# Altium project mcHFPro_ui.PrjPcb (part 1 of 2)
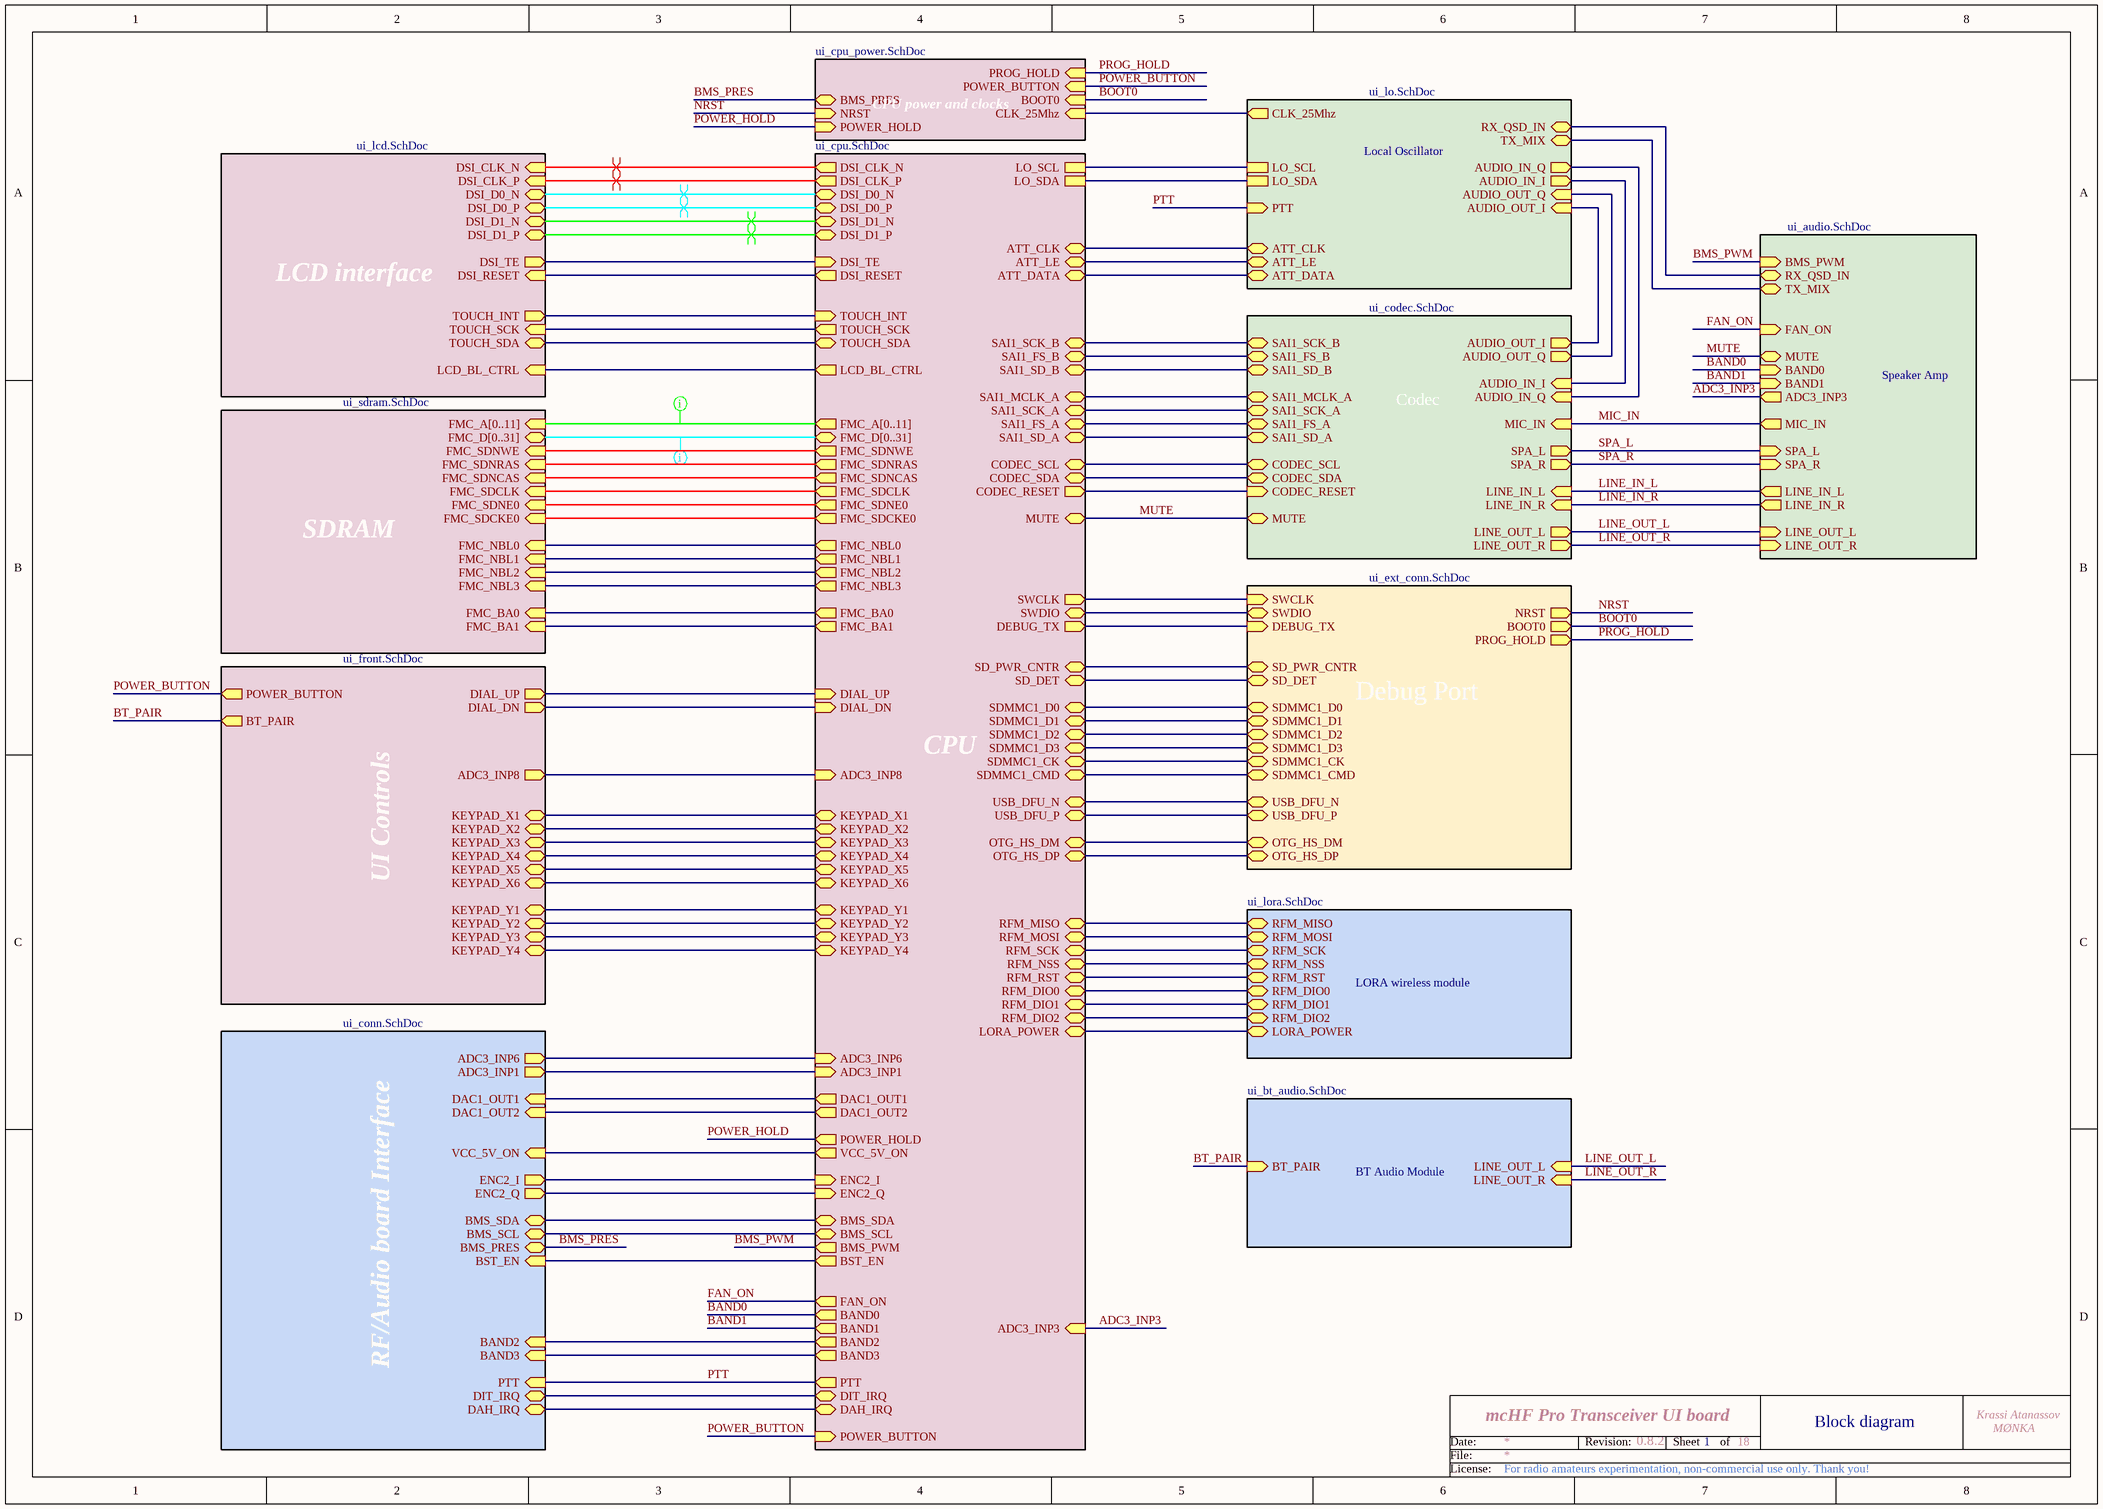
[diagram p0: ui_main.SchDoc]
13 sheets, 345 parts. Net scope: hierarchical (ports join the sheet entries above them; power ports are global).
Board file: mchf_pro_ui.PcbDoc
Sheets:
  ui_main.SchDoc
    UI Controls = ui_front.SchDoc
    RF/Audio board Interface = ui_conn.SchDoc
    CPU = ui_cpu.SchDoc
    SDRAM = ui_sdram.SchDoc
    LCD interface = ui_lcd.SchDoc
    CPU power and clocks = ui_cpu_power.SchDoc
    Local Oscillator = ui_lo.SchDoc
    Debug Port = ui_ext_conn.SchDoc
    Codec = ui_codec.SchDoc
    LORA wireless module = ui_lora.SchDoc
    Speaker Amp = ui_audio.SchDoc
    BT Audio Module = ui_bt_audio.SchDoc

## Sheet ui_main.SchDoc: mcHF Pro Transceiver UI board
size A3; Author: Krassi Atanassov; CompanyName: MØNKA; Engineer: For radio amateurs experimentation, non-commercial use only. Thank you!; Revision: 0.8.2; SheetTotal: 18

### Sub-sheets
BT Audio Module = ui_bt_audio.SchDoc: BT_PAIR (in), LINE_OUT_L (in), LINE_OUT_R (in)
Codec = ui_codec.SchDoc: CODEC_SCL (bidir), CODEC_RESET (in), CODEC_SDA (bidir), AUDIO_OUT_I (out), AUDIO_OUT_Q (out), AUDIO_IN_I (in), AUDIO_IN_Q (in), MIC_IN (in), SPA_L (out), MUTE (bidir), LINE_IN_L (in), LINE_IN_R (in), LINE_OUT_L (out), LINE_OUT_R (out), SPA_R (out), SAI1_SCK_B (bidir), SAI1_FS_B (bidir), SAI1_SD_B (bidir), SAI1_MCLK_A (bidir), SAI1_SCK_A (bidir), SAI1_FS_A (bidir), SAI1_SD_A (bidir)
CPU = ui_cpu.SchDoc: FMC_A[0..11] (out), FMC_D[0..31] (bidir), FMC_SDNWE (out), FMC_SDNRAS (out), FMC_SDNCAS (out), FMC_SDCLK (out), FMC_BA0 (out), FMC_BA1 (out), FMC_SDNE0 (out), FMC_SDCKE0 (out), FMC_NBL0 (out), FMC_NBL1 (out), DIAL_UP (in), DIAL_DN (in), FMC_NBL2 (out), FMC_NBL3 (out), SWCLK (out), SWDIO (bidir), SDMMC1_D0 (bidir), SDMMC1_D1 (bidir), SDMMC1_D2 (bidir), SDMMC1_D3 (bidir), SDMMC1_CK (bidir), SDMMC1_CMD (bidir), RFM_DIO0 (bidir), RFM_DIO1 (bidir), RFM_DIO2 (bidir), LORA_POWER (bidir), DSI_CLK_N (out), DSI_CLK_P (out), DSI_D0_N (bidir), DSI_D0_P (bidir), DSI_D1_N (bidir), DSI_D1_P (bidir), LCD_BL_CTRL (out), TOUCH_INT (in), TOUCH_SCK (out), TOUCH_SDA (bidir), DSI_TE (in), DSI_RESET (out), LO_SCL, LO_SDA, KEYPAD_X2 (bidir), KEYPAD_X4 (bidir), KEYPAD_X3 (bidir), KEYPAD_X5 (bidir), KEYPAD_X6 (bidir), KEYPAD_Y1 (bidir), KEYPAD_Y2 (bidir), KEYPAD_Y3 (bidir), ADC3_INP6 (in), KEYPAD_Y4 (bidir), ADC3_INP1 (in), POWER_HOLD (out), DAC1_OUT1 (out), DAC1_OUT2 (out), KEYPAD_X1 (bidir), CODEC_SCL (bidir), CODEC_SDA (bidir), SAI1_SCK_B (bidir), SAI1_FS_B (bidir), SAI1_SD_B (bidir), SAI1_MCLK_A (bidir), SAI1_SCK_A (bidir), SAI1_FS_A (bidir), SAI1_SD_A (bidir), DEBUG_TX (out), VCC_5V_ON (out), RFM_MISO (bidir), RFM_MOSI (bidir), RFM_NSS (bidir), BAND0 (out), BAND1 (out), BAND2 (out), BAND3 (out), PTT (out), DIT_IRQ (bidir), DAH_IRQ (bidir), ADC3_INP8 (in), USB_DFU_N (bidir), USB_DFU_P (bidir), CODEC_RESET (out), POWER_BUTTON (in), MUTE (bidir), RFM_SCK (bidir), SD_DET (bidir), SD_PWR_CNTR (bidir), OTG_HS_DM (bidir), OTG_HS_DP (bidir), RFM_RST (bidir), BMS_SDA (bidir), BMS_SCL (bidir), ENC2_I (in), ENC2_Q (in), FAN_ON (out), ATT_CLK (bidir), ATT_LE (bidir), ATT_DATA (bidir), ADC3_INP3 (in), BMS_PWM (out), BST_EN (out)
CPU power and clocks = ui_cpu_power.SchDoc: NRST (in), CLK_25Mhz (in), POWER_HOLD (in), POWER_BUTTON (in), BOOT0 (in), BMS_PRES (bidir), PROG_HOLD (in)
Debug Port = ui_ext_conn.SchDoc: SWCLK (in), SWDIO (bidir), NRST (out), SD_PWR_CNTR (bidir), SD_DET (bidir), DEBUG_TX (in), USB_DFU_N (bidir), USB_DFU_P (bidir), SDMMC1_D0 (bidir), SDMMC1_D1 (bidir), SDMMC1_D2 (bidir), SDMMC1_D3 (bidir), SDMMC1_CK (bidir), SDMMC1_CMD (bidir), OTG_HS_DM (bidir), OTG_HS_DP (bidir), BOOT0 (out), PROG_HOLD (out)
LCD interface = ui_lcd.SchDoc: DSI_CLK_N (in), LCD_BL_CTRL (in), TOUCH_INT (out), TOUCH_SCK (in), TOUCH_SDA (bidir), DSI_CLK_P (in), DSI_D0_N (bidir), DSI_D0_P (bidir), DSI_D1_N (bidir), DSI_D1_P (bidir), DSI_TE (out), DSI_RESET (in)
Local Oscillator = ui_lo.SchDoc: LO_SCL, LO_SDA, CLK_25Mhz (out), AUDIO_OUT_I (in), AUDIO_OUT_Q (in), AUDIO_IN_I (out), AUDIO_IN_Q (out), TX_MIX (bidir), RX_QSD_IN (bidir), PTT (in), ATT_CLK (bidir), ATT_LE (bidir), ATT_DATA (bidir)
LORA wireless module = ui_lora.SchDoc: RFM_MISO (bidir), RFM_MOSI (bidir), RFM_SCK (bidir), RFM_NSS (bidir), RFM_RST (bidir), RFM_DIO0 (bidir), LORA_POWER (bidir), RFM_DIO1 (bidir), RFM_DIO2 (bidir)
RF/Audio board Interface = ui_conn.SchDoc: ADC3_INP6 (out), ADC3_INP1 (out), DAC1_OUT1 (in), DAC1_OUT2 (in), VCC_5V_ON (in), BAND2 (in), BAND3 (in), PTT (in), DIT_IRQ (bidir), DAH_IRQ (bidir), BMS_SDA (bidir), BMS_SCL (bidir), BMS_PRES (bidir), ENC2_I (out), ENC2_Q (out), BST_EN (in)
SDRAM = ui_sdram.SchDoc: FMC_A[0..11] (in), FMC_D[0..31] (bidir), FMC_SDNWE (in), FMC_SDNRAS (in), FMC_SDNCAS (in), FMC_SDCLK (in), FMC_BA0 (in), FMC_BA1 (in), FMC_NBL0 (in), FMC_NBL1 (in), FMC_SDNE0 (in), FMC_SDCKE0 (in), FMC_NBL2 (in), FMC_NBL3 (in)
Speaker Amp = ui_audio.SchDoc: MIC_IN (out), SPA_L (in), MUTE (bidir), LINE_IN_L (out), LINE_IN_R (out), LINE_OUT_L (in), LINE_OUT_R (in), SPA_R (in), BMS_PWM (in), TX_MIX (bidir), RX_QSD_IN (bidir), BAND0 (in), BAND1 (in), FAN_ON (in), ADC3_INP3 (out)
UI Controls = ui_front.SchDoc: KEYPAD_X1 (bidir), KEYPAD_X2 (bidir), KEYPAD_X3 (bidir), KEYPAD_X4 (bidir), KEYPAD_X5 (bidir), KEYPAD_X6 (bidir), KEYPAD_Y1 (bidir), KEYPAD_Y2 (bidir), KEYPAD_Y3 (bidir), KEYPAD_Y4 (bidir), DIAL_UP (out), DIAL_DN (out), POWER_BUTTON (out), ADC3_INP8 (out), BT_PAIR (out)

### Nets
ADC3_INP1: sheet RF/Audio board Interface/ADC3_INP1, sheet CPU/ADC3_INP1
ADC3_INP3: sheet CPU/ADC3_INP3, sheet Speaker Amp/ADC3_INP3
ADC3_INP6: sheet RF/Audio board Interface/ADC3_INP6, sheet CPU/ADC3_INP6
ADC3_INP8: sheet UI Controls/ADC3_INP8, sheet CPU/ADC3_INP8
ATT_CLK: sheet CPU/ATT_CLK, sheet Local Oscillator/ATT_CLK
ATT_DATA: sheet CPU/ATT_DATA, sheet Local Oscillator/ATT_DATA
ATT_LE: sheet CPU/ATT_LE, sheet Local Oscillator/ATT_LE
BAND0: sheet CPU/BAND0, sheet Speaker Amp/BAND0
BAND1: sheet CPU/BAND1, sheet Speaker Amp/BAND1
BAND2: sheet RF/Audio board Interface/BAND2, sheet CPU/BAND2
BAND3: sheet RF/Audio board Interface/BAND3, sheet CPU/BAND3
BMS_PRES: sheet RF/Audio board Interface/BMS_PRES, sheet CPU power and clocks/BMS_PRES
BMS_PWM: sheet CPU/BMS_PWM, sheet Speaker Amp/BMS_PWM
BMS_SCL: sheet RF/Audio board Interface/BMS_SCL, sheet CPU/BMS_SCL
BMS_SDA: sheet RF/Audio board Interface/BMS_SDA, sheet CPU/BMS_SDA
BOOT0: sheet CPU power and clocks/BOOT0, sheet Debug Port/BOOT0
BST_EN: sheet RF/Audio board Interface/BST_EN, sheet CPU/BST_EN
BT_PAIR: sheet UI Controls/BT_PAIR, sheet BT Audio Module/BT_PAIR
CODEC_RESET: sheet CPU/CODEC_RESET, sheet Codec/CODEC_RESET
CODEC_SCL: sheet CPU/CODEC_SCL, sheet Codec/CODEC_SCL
CODEC_SDA: sheet CPU/CODEC_SDA, sheet Codec/CODEC_SDA
DAC1_OUT1: sheet RF/Audio board Interface/DAC1_OUT1, sheet CPU/DAC1_OUT1
DAC1_OUT2: sheet RF/Audio board Interface/DAC1_OUT2, sheet CPU/DAC1_OUT2
DAH_IRQ: sheet RF/Audio board Interface/DAH_IRQ, sheet CPU/DAH_IRQ
DIAL_DN: sheet UI Controls/DIAL_DN, sheet CPU/DIAL_DN
DIAL_UP: sheet UI Controls/DIAL_UP, sheet CPU/DIAL_UP
DIT_IRQ: sheet RF/Audio board Interface/DIT_IRQ, sheet CPU/DIT_IRQ
DSI_CLK_N: sheet CPU/DSI_CLK_N, sheet LCD interface/DSI_CLK_N
DSI_CLK_P: sheet CPU/DSI_CLK_P, sheet LCD interface/DSI_CLK_P
DSI_D0_N: sheet CPU/DSI_D0_N, sheet LCD interface/DSI_D0_N
DSI_D0_P: sheet CPU/DSI_D0_P, sheet LCD interface/DSI_D0_P
DSI_D1_N: sheet CPU/DSI_D1_N, sheet LCD interface/DSI_D1_N
DSI_D1_P: sheet CPU/DSI_D1_P, sheet LCD interface/DSI_D1_P
DSI_RESET: sheet CPU/DSI_RESET, sheet LCD interface/DSI_RESET
DSI_TE: sheet CPU/DSI_TE, sheet LCD interface/DSI_TE
ENC2_I: sheet RF/Audio board Interface/ENC2_I, sheet CPU/ENC2_I
ENC2_Q: sheet RF/Audio board Interface/ENC2_Q, sheet CPU/ENC2_Q
FAN_ON: sheet CPU/FAN_ON, sheet Speaker Amp/FAN_ON
FMC_BA0: sheet CPU/FMC_BA0, sheet SDRAM/FMC_BA0
FMC_BA1: sheet CPU/FMC_BA1, sheet SDRAM/FMC_BA1
FMC_NBL0: sheet CPU/FMC_NBL0, sheet SDRAM/FMC_NBL0
FMC_NBL1: sheet CPU/FMC_NBL1, sheet SDRAM/FMC_NBL1
FMC_NBL2: sheet CPU/FMC_NBL2, sheet SDRAM/FMC_NBL2
FMC_NBL3: sheet CPU/FMC_NBL3, sheet SDRAM/FMC_NBL3
FMC_SDCKE0: sheet CPU/FMC_SDCKE0, sheet SDRAM/FMC_SDCKE0
FMC_SDCLK: sheet CPU/FMC_SDCLK, sheet SDRAM/FMC_SDCLK
FMC_SDNCAS: sheet CPU/FMC_SDNCAS, sheet SDRAM/FMC_SDNCAS
FMC_SDNE0: sheet CPU/FMC_SDNE0, sheet SDRAM/FMC_SDNE0
FMC_SDNRAS: sheet CPU/FMC_SDNRAS, sheet SDRAM/FMC_SDNRAS
FMC_SDNWE: sheet CPU/FMC_SDNWE, sheet SDRAM/FMC_SDNWE
KEYPAD_X1: sheet UI Controls/KEYPAD_X1, sheet CPU/KEYPAD_X1
KEYPAD_X2: sheet UI Controls/KEYPAD_X2, sheet CPU/KEYPAD_X2
KEYPAD_X3: sheet UI Controls/KEYPAD_X3, sheet CPU/KEYPAD_X3
KEYPAD_X4: sheet UI Controls/KEYPAD_X4, sheet CPU/KEYPAD_X4
KEYPAD_X5: sheet UI Controls/KEYPAD_X5, sheet CPU/KEYPAD_X5
KEYPAD_X6: sheet UI Controls/KEYPAD_X6, sheet CPU/KEYPAD_X6
KEYPAD_Y1: sheet UI Controls/KEYPAD_Y1, sheet CPU/KEYPAD_Y1
KEYPAD_Y2: sheet UI Controls/KEYPAD_Y2, sheet CPU/KEYPAD_Y2
KEYPAD_Y3: sheet UI Controls/KEYPAD_Y3, sheet CPU/KEYPAD_Y3
KEYPAD_Y4: sheet UI Controls/KEYPAD_Y4, sheet CPU/KEYPAD_Y4
LCD_BL_CTRL: sheet CPU/LCD_BL_CTRL, sheet LCD interface/LCD_BL_CTRL
LINE_IN_L: sheet Codec/LINE_IN_L, sheet Speaker Amp/LINE_IN_L
LINE_IN_R: sheet Codec/LINE_IN_R, sheet Speaker Amp/LINE_IN_R
LINE_OUT_L: sheet Codec/LINE_OUT_L, sheet Speaker Amp/LINE_OUT_L, sheet BT Audio Module/LINE_OUT_L
LINE_OUT_R: sheet Codec/LINE_OUT_R, sheet Speaker Amp/LINE_OUT_R, sheet BT Audio Module/LINE_OUT_R
LO_SCL: sheet CPU/LO_SCL, sheet Local Oscillator/LO_SCL
LO_SDA: sheet CPU/LO_SDA, sheet Local Oscillator/LO_SDA
LORA_POWER: sheet CPU/LORA_POWER, sheet LORA wireless module/LORA_POWER
MIC_IN: sheet Codec/MIC_IN, sheet Speaker Amp/MIC_IN
MUTE: sheet CPU/MUTE, sheet Codec/MUTE, sheet Speaker Amp/MUTE
NRST: sheet CPU power and clocks/NRST, sheet Debug Port/NRST
OTG_HS_DM: sheet CPU/OTG_HS_DM, sheet Debug Port/OTG_HS_DM
OTG_HS_DP: sheet CPU/OTG_HS_DP, sheet Debug Port/OTG_HS_DP
POWER_BUTTON: sheet UI Controls/POWER_BUTTON, sheet CPU/POWER_BUTTON, sheet CPU power and clocks/POWER_BUTTON
POWER_HOLD: sheet CPU/POWER_HOLD, sheet CPU power and clocks/POWER_HOLD
PROG_HOLD: sheet CPU power and clocks/PROG_HOLD, sheet Debug Port/PROG_HOLD
PTT: sheet RF/Audio board Interface/PTT, sheet CPU/PTT, sheet Local Oscillator/PTT
RFM_DIO0: sheet CPU/RFM_DIO0, sheet LORA wireless module/RFM_DIO0
RFM_DIO1: sheet CPU/RFM_DIO1, sheet LORA wireless module/RFM_DIO1
RFM_DIO2: sheet CPU/RFM_DIO2, sheet LORA wireless module/RFM_DIO2
RFM_MISO: sheet CPU/RFM_MISO, sheet LORA wireless module/RFM_MISO
RFM_MOSI: sheet CPU/RFM_MOSI, sheet LORA wireless module/RFM_MOSI
RFM_NSS: sheet CPU/RFM_NSS, sheet LORA wireless module/RFM_NSS
RFM_RST: sheet CPU/RFM_RST, sheet LORA wireless module/RFM_RST
RFM_SCK: sheet CPU/RFM_SCK, sheet LORA wireless module/RFM_SCK
RX_QSD_IN: sheet Local Oscillator/RX_QSD_IN, sheet Speaker Amp/RX_QSD_IN
SAI1_FS_A: sheet CPU/SAI1_FS_A, sheet Codec/SAI1_FS_A
SAI1_FS_B: sheet CPU/SAI1_FS_B, sheet Codec/SAI1_FS_B
SAI1_MCLK_A: sheet CPU/SAI1_MCLK_A, sheet Codec/SAI1_MCLK_A
SAI1_SCK_A: sheet CPU/SAI1_SCK_A, sheet Codec/SAI1_SCK_A
SAI1_SCK_B: sheet CPU/SAI1_SCK_B, sheet Codec/SAI1_SCK_B
SAI1_SD_A: sheet CPU/SAI1_SD_A, sheet Codec/SAI1_SD_A
SAI1_SD_B: sheet CPU/SAI1_SD_B, sheet Codec/SAI1_SD_B
SD_DET: sheet CPU/SD_DET, sheet Debug Port/SD_DET
SD_PWR_CNTR: sheet CPU/SD_PWR_CNTR, sheet Debug Port/SD_PWR_CNTR
SDMMC1_CK: sheet CPU/SDMMC1_CK, sheet Debug Port/SDMMC1_CK
SDMMC1_CMD: sheet CPU/SDMMC1_CMD, sheet Debug Port/SDMMC1_CMD
SDMMC1_D0: sheet CPU/SDMMC1_D0, sheet Debug Port/SDMMC1_D0
SDMMC1_D1: sheet CPU/SDMMC1_D1, sheet Debug Port/SDMMC1_D1
SDMMC1_D2: sheet CPU/SDMMC1_D2, sheet Debug Port/SDMMC1_D2
SDMMC1_D3: sheet CPU/SDMMC1_D3, sheet Debug Port/SDMMC1_D3
SPA_L: sheet Codec/SPA_L, sheet Speaker Amp/SPA_L
SPA_R: sheet Codec/SPA_R, sheet Speaker Amp/SPA_R
SWCLK: sheet CPU/SWCLK, sheet Debug Port/SWCLK
SWDIO: sheet CPU/SWDIO, sheet Debug Port/SWDIO
TOUCH_INT: sheet CPU/TOUCH_INT, sheet LCD interface/TOUCH_INT
TOUCH_SCK: sheet CPU/TOUCH_SCK, sheet LCD interface/TOUCH_SCK
TOUCH_SDA: sheet CPU/TOUCH_SDA, sheet LCD interface/TOUCH_SDA
TX_MIX: sheet Local Oscillator/TX_MIX, sheet Speaker Amp/TX_MIX
USART2_TX: sheet CPU/DEBUG_TX, sheet Debug Port/DEBUG_TX
USB_DFU_N: sheet CPU/USB_DFU_N, sheet Debug Port/USB_DFU_N
USB_DFU_P: sheet CPU/USB_DFU_P, sheet Debug Port/USB_DFU_P
VCC_5V_ON: sheet RF/Audio board Interface/VCC_5V_ON, sheet CPU/VCC_5V_ON
NetC6_2: sheet Local Oscillator/AUDIO_OUT_I, sheet Codec/AUDIO_OUT_I
NetC7_2: sheet Local Oscillator/AUDIO_OUT_Q, sheet Codec/AUDIO_OUT_Q
NetC8_2: sheet Local Oscillator/AUDIO_IN_I, sheet Codec/AUDIO_IN_I
NetC9_2: sheet Local Oscillator/AUDIO_IN_Q, sheet Codec/AUDIO_IN_Q
NetR59_1: sheet CPU power and clocks/CLK_25Mhz, sheet Local Oscillator/CLK_25Mhz

### Buses and harness runs
bus sheet CPU/FMC_A[0..11] = sheet SDRAM/FMC_A[0..11]
bus sheet CPU/FMC_D[0..31] = sheet SDRAM/FMC_D[0..31]

### Layout directives
differential pair: DSI_CLK_N, DSI_CLK_P, DSI_D0_N, DSI_D0_P, DSI_D1_N, DSI_D1_P
rule Matched Net Lengths [Tolerance = 100mil]: (no net found under the mark)

### Notes on the sheet
- 1
- Block diagram
- Date:
- File:
- Revision:
- Sheet
- of
- License:

## Sheet ui_front.SchDoc: mcHF Pro Transceiver UI board
size A3; Author: Krassi Atanassov; CompanyName: MØNKA; Engineer: For radio amateurs experimentation, non-commercial use only. Thank you!; Revision: 0.8.5; SheetTotal: 13
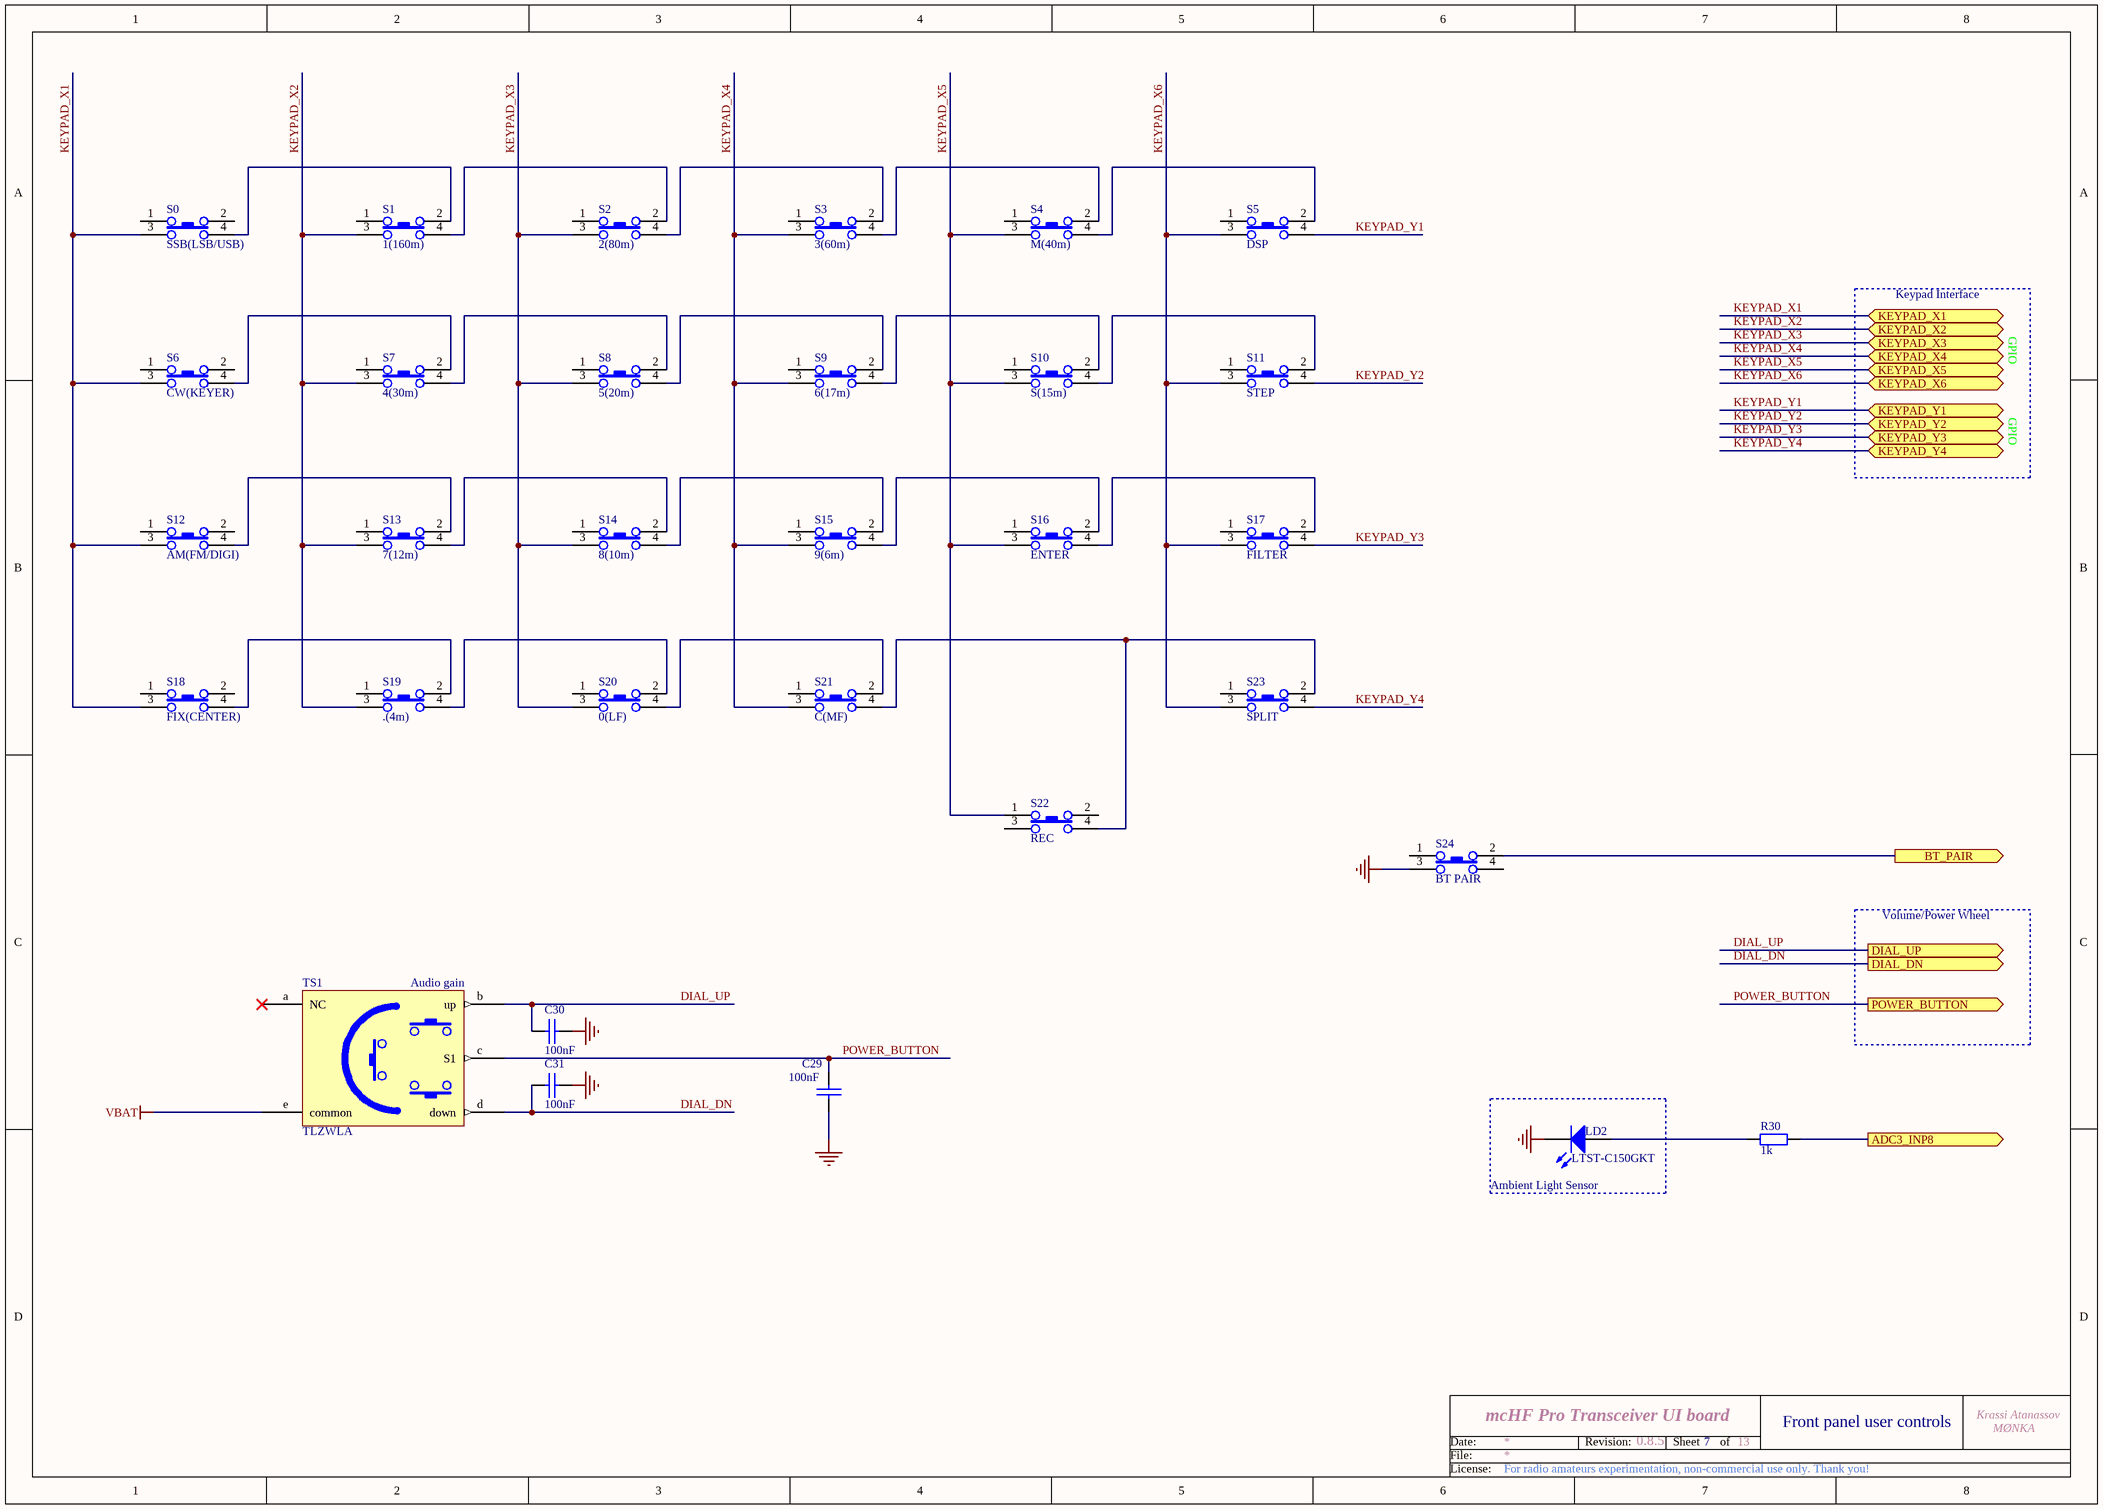
[diagram p1: ui_front.SchDoc]

### Parts
C29  100nF  [0805]
C30  100nF  [0805]
C31  100nF  [0805]
LD2  LTST-C150GKT  [1206_Elec_Cap]  (no BOM)
R30  1k  [0805]
S0  SSB(LSB/USB)  [BUTTON_SMD2]  (no BOM)
S1  1(160m)  [BUTTON_SMD2]  (no BOM)
S2  2(80m)  [BUTTON_SMD2]  (no BOM)
S3  3(60m)  [BUTTON_SMD2]  (no BOM)
S4  M(40m)  [BUTTON_SMD2]  (no BOM)
S5  DSP  [BUTTON_SMD2]  (no BOM)
S6  CW(KEYER)  [BUTTON_SMD2]  (no BOM)
S7  4(30m)  [BUTTON_SMD2]  (no BOM)
S8  5(20m)  [BUTTON_SMD2]  (no BOM)
S9  6(17m)  [BUTTON_SMD2]  (no BOM)
S10  S(15m)  [BUTTON_SMD2]  (no BOM)
S11  STEP  [BUTTON_SMD2]  (no BOM)
S12  AM(FM/DIGI)  [BUTTON_SMD2]  (no BOM)
S13  7(12m)  [BUTTON_SMD2]  (no BOM)
S14  8(10m)  [BUTTON_SMD2]  (no BOM)
S15  9(6m)  [BUTTON_SMD2]  (no BOM)
S16  ENTER  [BUTTON_SMD2]  (no BOM)
S17  FILTER  [BUTTON_SMD2]  (no BOM)
S18  FIX(CENTER)  [BUTTON_SMD2]  (no BOM)
S19  .(4m)  [BUTTON_SMD2]  (no BOM)
S20  0(LF)  [BUTTON_SMD2]  (no BOM)
S21  C(MF)  [BUTTON_SMD2]  (no BOM)
S22  REC  [BUTTON_SMD3]
S23  SPLIT  [BUTTON_SMD2]  (no BOM)
S24  BT PAIR  [BUTTON_SMD3]
TS1  TLZWLA  [TLZWLA]

### Blocks framed on the sheet
Ambient Light Sensor: LD2

### Ports
ADC3_INP8 (out), BT_PAIR (out), DIAL_DN (out), DIAL_UP (out), KEYPAD_X1 (bidir), KEYPAD_X2 (bidir), KEYPAD_X3 (bidir), KEYPAD_X4 (bidir), KEYPAD_X5 (bidir), KEYPAD_X6 (bidir), KEYPAD_Y1 (bidir), KEYPAD_Y2 (bidir), KEYPAD_Y3 (bidir), KEYPAD_Y4 (bidir), POWER_BUTTON (out)

### Nets
GND: C29.1 C30.2 C31.2 LD2.2(K) S24.3
VBAT: TS1.e(common)
ADC3_INP8: R30.1 ; port ADC3_INP8
BT_PAIR: S24.2 ; port BT_PAIR
DIAL_DN: C31.1 TS1.d(down) ; port DIAL_DN
DIAL_UP: C30.1 TS1.b(up) ; port DIAL_UP
KEYPAD_X1: S0.3 S6.3 S12.3 S18.3 ; port KEYPAD_X1
KEYPAD_X2: S1.3 S7.3 S13.3 S19.3 ; port KEYPAD_X2
KEYPAD_X3: S2.3 S8.3 S14.3 S20.3 ; port KEYPAD_X3
KEYPAD_X4: S3.3 S9.3 S15.3 S21.3 ; port KEYPAD_X4
KEYPAD_X5: S4.3 S10.3 S16.3 S22.1 ; port KEYPAD_X5
KEYPAD_X6: S5.3 S11.3 S17.3 S23.3 ; port KEYPAD_X6
KEYPAD_Y1: S5.4 ; port KEYPAD_Y1
KEYPAD_Y2: S11.4 ; port KEYPAD_Y2
KEYPAD_Y3: S17.4 ; port KEYPAD_Y3
KEYPAD_Y4: S23.4 ; port KEYPAD_Y4
POWER_BUTTON: C29.2 TS1.c(S1) ; port POWER_BUTTON
NetLD2_1: LD2.1(A) R30.2
NetS0_4: S0.4 S1.2
NetS1_4: S1.4 S2.2
NetS2_4: S2.4 S3.2
NetS3_4: S3.4 S4.2
NetS4_4: S4.4 S5.2
NetS6_4: S6.4 S7.2
NetS7_4: S7.4 S8.2
NetS8_4: S8.4 S9.2
NetS9_4: S9.4 S10.2
NetS10_4: S10.4 S11.2
NetS12_4: S12.4 S13.2
NetS13_4: S13.4 S14.2
NetS14_4: S14.4 S15.2
NetS15_4: S15.4 S16.2
NetS16_4: S16.4 S17.2
NetS18_4: S18.4 S19.2
NetS19_4: S19.4 S20.2
NetS20_4: S20.4 S21.2
NetS21_4: S21.4 S22.4 S23.2

Not connected (* = marked no-connect by the designer): S0 1 2; S1 1; S2 1; S3 1; S4 1; S5 1; S6 1 2; S7 1; S8 1; S9 1; S10 1; S11 1; S12 1 2; S13 1; S14 1; S15 1; S16 1; S17 1; S18 1 2; S19 1; S20 1; S21 1; S22 2 3; S23 1; S24 1 4; TS1 a(NC)*

### Notes on the sheet
- Keypad Interface
- GPIO
- Volume/Power Wheel
- (near TS1) Audio gain
- 7
- Front panel user controls
- Date:
- File:
- Revision:
- Sheet
- of
- License:

### Library data of the parts
C29 = CAP: Capacitor; Order: FN 282-1264; QT Order: QCC-00157; Price: 0.089
C30 = CAP: Capacitor; Order: FN 190-7054; QT Order: QCC-00259; QT Price: 0.05; Price: 0.038
C31 = CAP: Capacitor; Order: FN 190-7054; QT Order: QCC-00259; Price: 0.038
LD2 = LED2: LED 3mm; QT Order: QCD-00052; Revision: July-2002: Re-released for DXP Platform.; Price: 0.116
R30 = RES: Resistor; Order: FN 146-9899; QT Order: QCR-00309; Price: 0.023
S0-S21 S23 = SW-PB: Push Button
S22 S24 = SW-PBS: Push Side Button
TS1 = TLZWLA: Thumbwheel Toggle Switch; Order: FN 206-4978

## Sheet ui_conn.SchDoc: mcHF Pro Transceiver UI board
size A3; Author: Krassi Atanassov; CompanyName: MØNKA; Engineer: For radio amateurs experimentation, non-commercial use only. Thank you!; Revision: 0.8.5; SheetTotal: 13
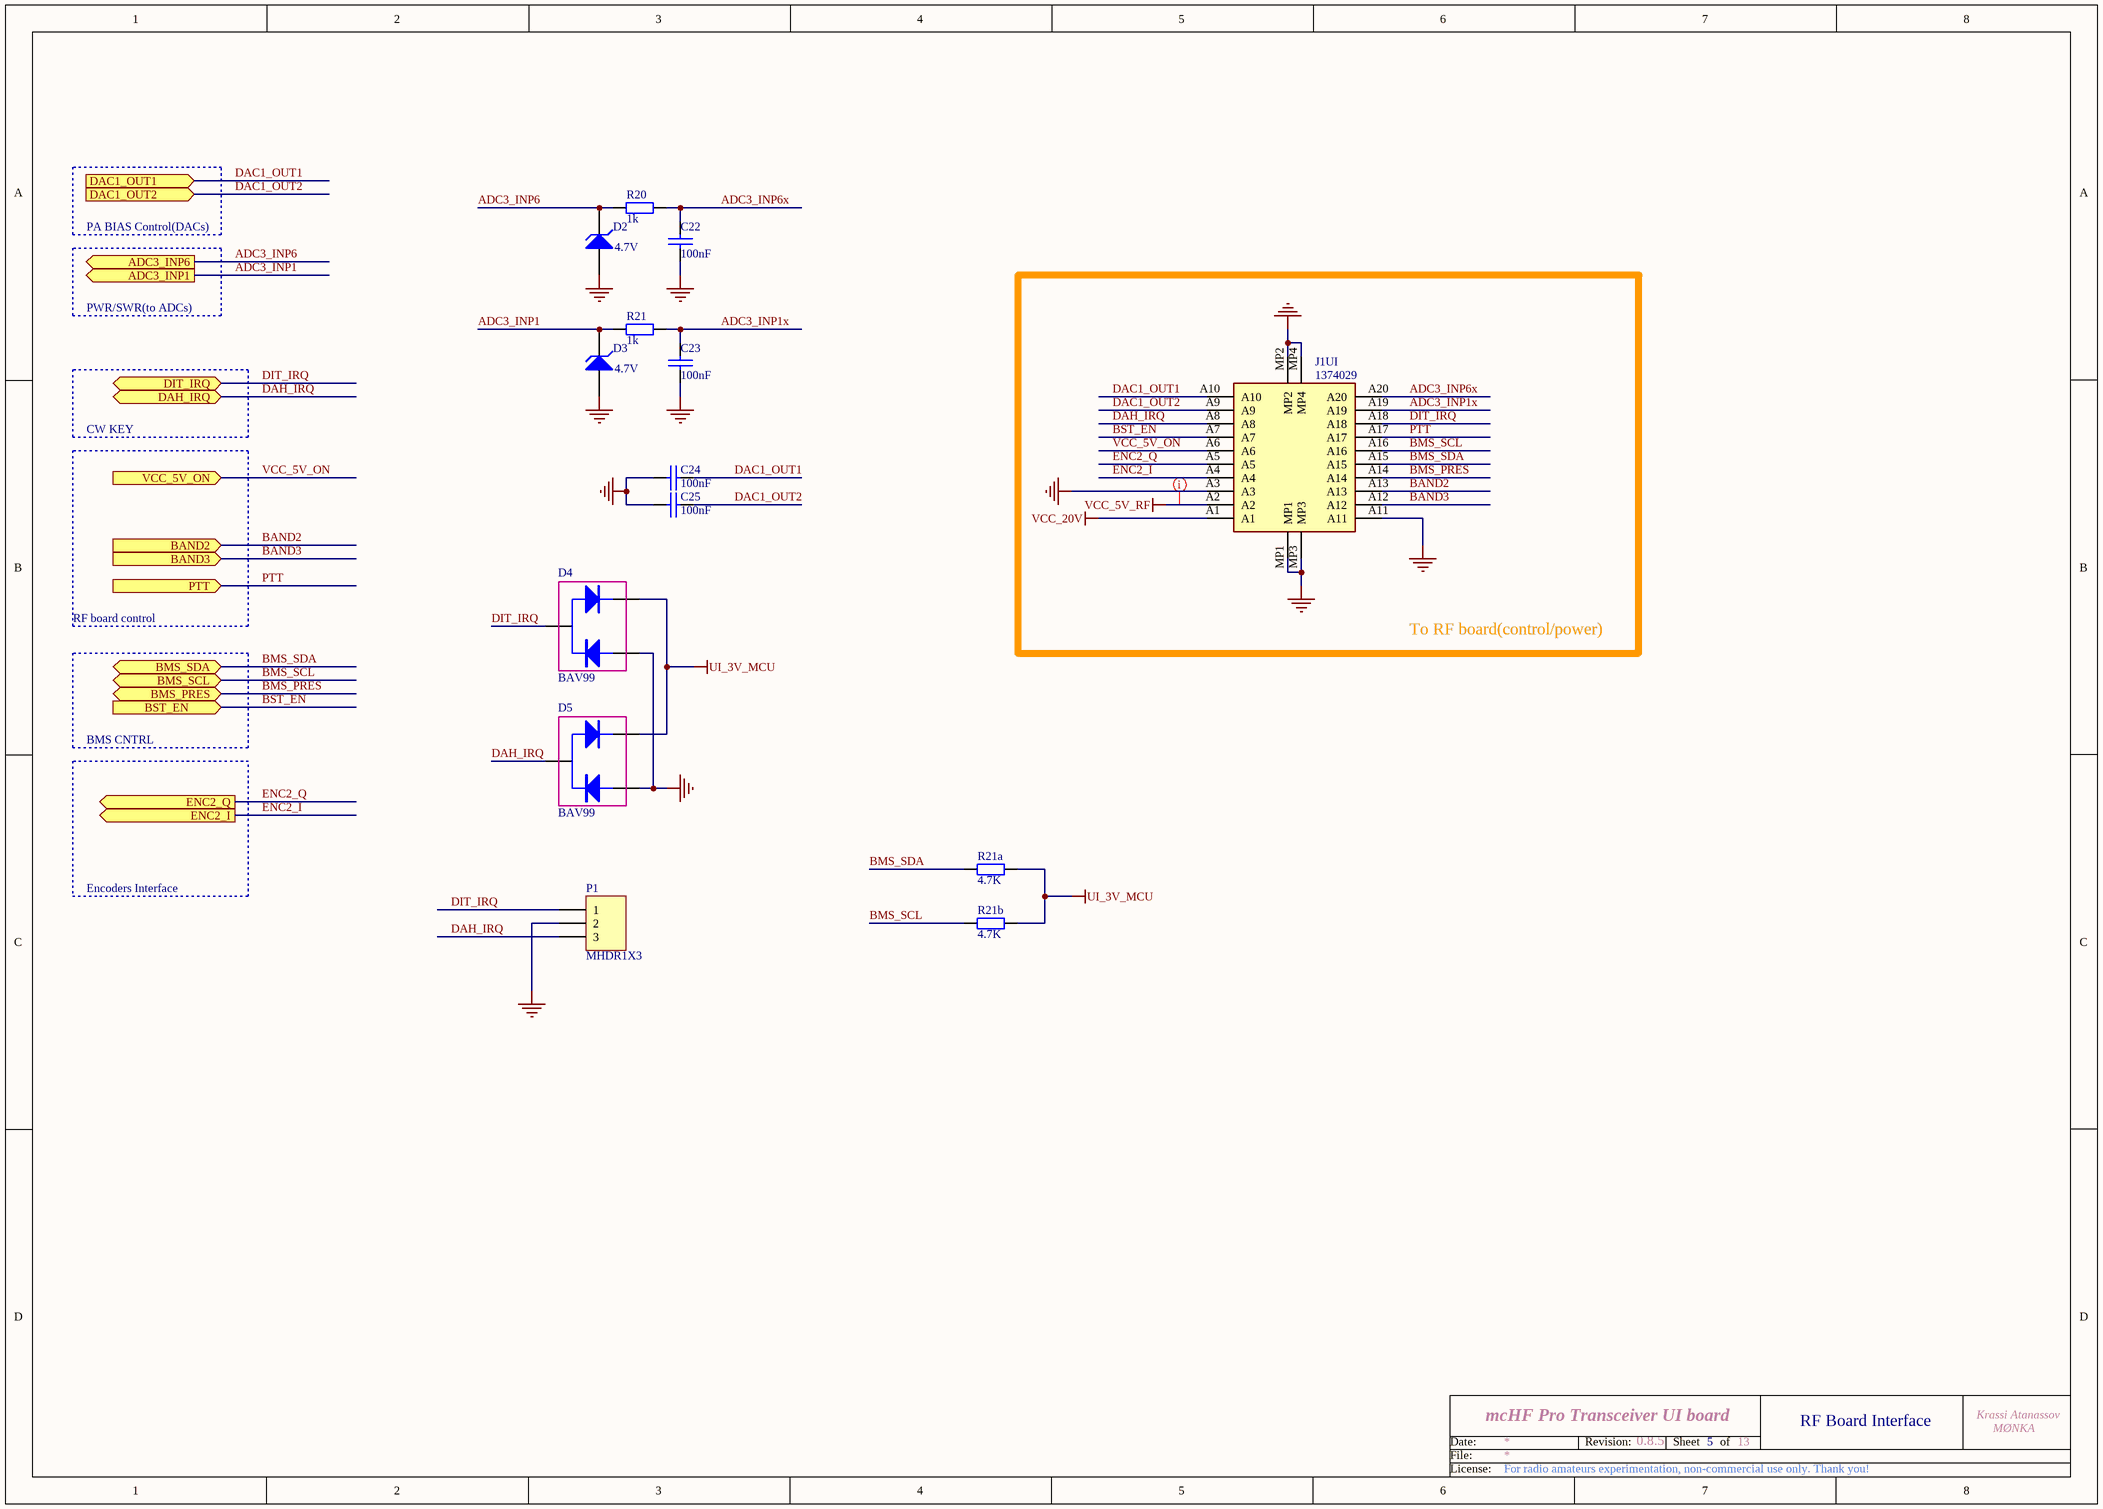
[diagram p2: ui_conn.SchDoc]

### Parts
C22  100nF  [0805]
C23  100nF  [0805]
C24  100nF  [0805]
C25  100nF  [0805]
D2  4.7V  [0805P]
D3  4.7V  [0805P]
D4  BAV99  [SOT-23]
D5  BAV99  [SOT-23]
J1UI  1374029  [1373866]
P1  MHDR1X3  [MHDR1X3]
R20  1k  [0805]
R21  1k  [0805]
R21a  4.7K  [0805]
R21b  4.7K  [0805]

### Blocks framed on the sheet
To RF board(control/power): J1UI

### Ports
ADC3_INP1 (out), ADC3_INP6 (out), BAND2 (in), BAND3 (in), BMS_PRES (bidir), BMS_SCL (bidir), BMS_SDA (bidir), BST_EN (in), DAC1_OUT1 (in), DAC1_OUT2 (in), DAH_IRQ (bidir), DIT_IRQ (bidir), ENC2_I (out), ENC2_Q (out), PTT (in), VCC_5V_ON (in)

### Nets
GND: C22.1 C23.1 C24.2 C25.2 D2.1(A) D3.1(A) D4.1(A1) D5.1(A1) J1UI.A3 J1UI.A11 J1UI.MP1 J1UI.MP2 J1UI.MP3 J1UI.MP4 P1.2
UI_3V_MCU: D4.2(K1) D5.2(K1) R21a.2 R21b.2
VCC_5V_RF: J1UI.A2
VCC_20V: J1UI.A1
ADC3_INP1: D3.2(K) R21.2 ; port ADC3_INP1
ADC3_INP1x: C23.2 J1UI.A19 R21.1
ADC3_INP6: D2.2(K) R20.2 ; port ADC3_INP6
ADC3_INP6x: C22.2 J1UI.A20 R20.1
BAND2: J1UI.A13 ; port BAND2
BAND3: J1UI.A12 ; port BAND3
BMS_PRES: J1UI.A14 ; port BMS_PRES
BMS_SCL: J1UI.A16 R21b.1 ; port BMS_SCL
BMS_SDA: J1UI.A15 R21a.1 ; port BMS_SDA
BST_EN: J1UI.A7 ; port BST_EN
DAC1_OUT1: C24.1 J1UI.A10 ; port DAC1_OUT1
DAC1_OUT2: C25.1 J1UI.A9 ; port DAC1_OUT2
DAH_IRQ: D5.3(C) J1UI.A8 P1.3 ; port DAH_IRQ
DIT_IRQ: D4.3(C) J1UI.A18 P1.1 ; port DIT_IRQ
ENC2_I: J1UI.A4 ; port ENC2_I
ENC2_Q: J1UI.A5 ; port ENC2_Q
PTT: J1UI.A17 ; port PTT
VCC_5V_ON: J1UI.A6 ; port VCC_5V_ON

### Layout directives
rule Width Constraint [Pref Width = 20mil    Min Width = 20mil    Max Width = 20mil]: VCC_5V_RF

### Notes on the sheet
- PA BIAS Control(DACs)
- PWR/SWR(to ADCs)
- CW KEY
- RF board control
- BMS CNTRL
- Encoders Interface
- 5
- RF Board Interface
- Date:
- File:
- Revision:
- Sheet
- of
- License:

### Library data of the parts
C22-C25 = CAP: Capacitor; Order: FN 252-2090; QT Order: QCC-00154; Price: 0.068
D2 D3 = D Zener: Zener Diode; Published: 8-Jun-2000; LatestRevisionDate: 17-Jul-2002; LatestRevisionNote: Re-released for DXP Platform.; PackageReference: DIODE-0.7; Publisher: Altium Limited; PackageDescription: Diode, Thru-Hole; 2 Leads; 0.7 in Pin Spacing
D4 = BAV99: Small Signal Diode, Dual Series; Order: FN 162-1837; QT Order: QCD-00039; Price: 0.0618
D5 = BAV99: Small Signal Diode, Dual Series; Order: FN 162-1837; Price: 0.0618
J1UI = 1373866: SMD male connector, nominal current: 2.2 A, Test voltage: 840 VAC, number of positions: 20, pitch: 1.27 mm, color: black, contact surface: Gold, type of contact: Male connector, mounting: SMD soldering; Manufacturer_Name: Phoenix Contact; Geometry.Height: 6.75mm; Mouser Part Number: 651-1373866; Mouser Price/Stock: https://www.mouser.co.uk/ProductDetail/Phoenix-Contact/1373866?qs=2SLPxufLcgAs0enIXKjUUw%3D%3D; Manufacturer_Part_Number: 1373866; Datasheet Link: http://www.phoenixcontact.com/gb/produkte/1373866
P1 = MHDR1X3: Header, 3-Pin; LatestRevisionDate: 17-Jul-2002; LatestRevisionNote: Re-released for DXP Platform.; Publisher: Altium Limited
R20 R21 = RES: as R30 on sheet ui_front; Price: 0.023
R21a R21b = RES: Resistor; Order: FN 200-8383; QT Order: QCR-00341; Price: 0.024

## Sheet ui_cpu.SchDoc: mcHF Pro Transceiver UI board
size A3; Author: Krassi Atanassov; CompanyName: MØNKA; Engineer: For radio amateurs experimentation, non-commercial use only. Thank you!; Revision: 0.8.5; SheetTotal: 13
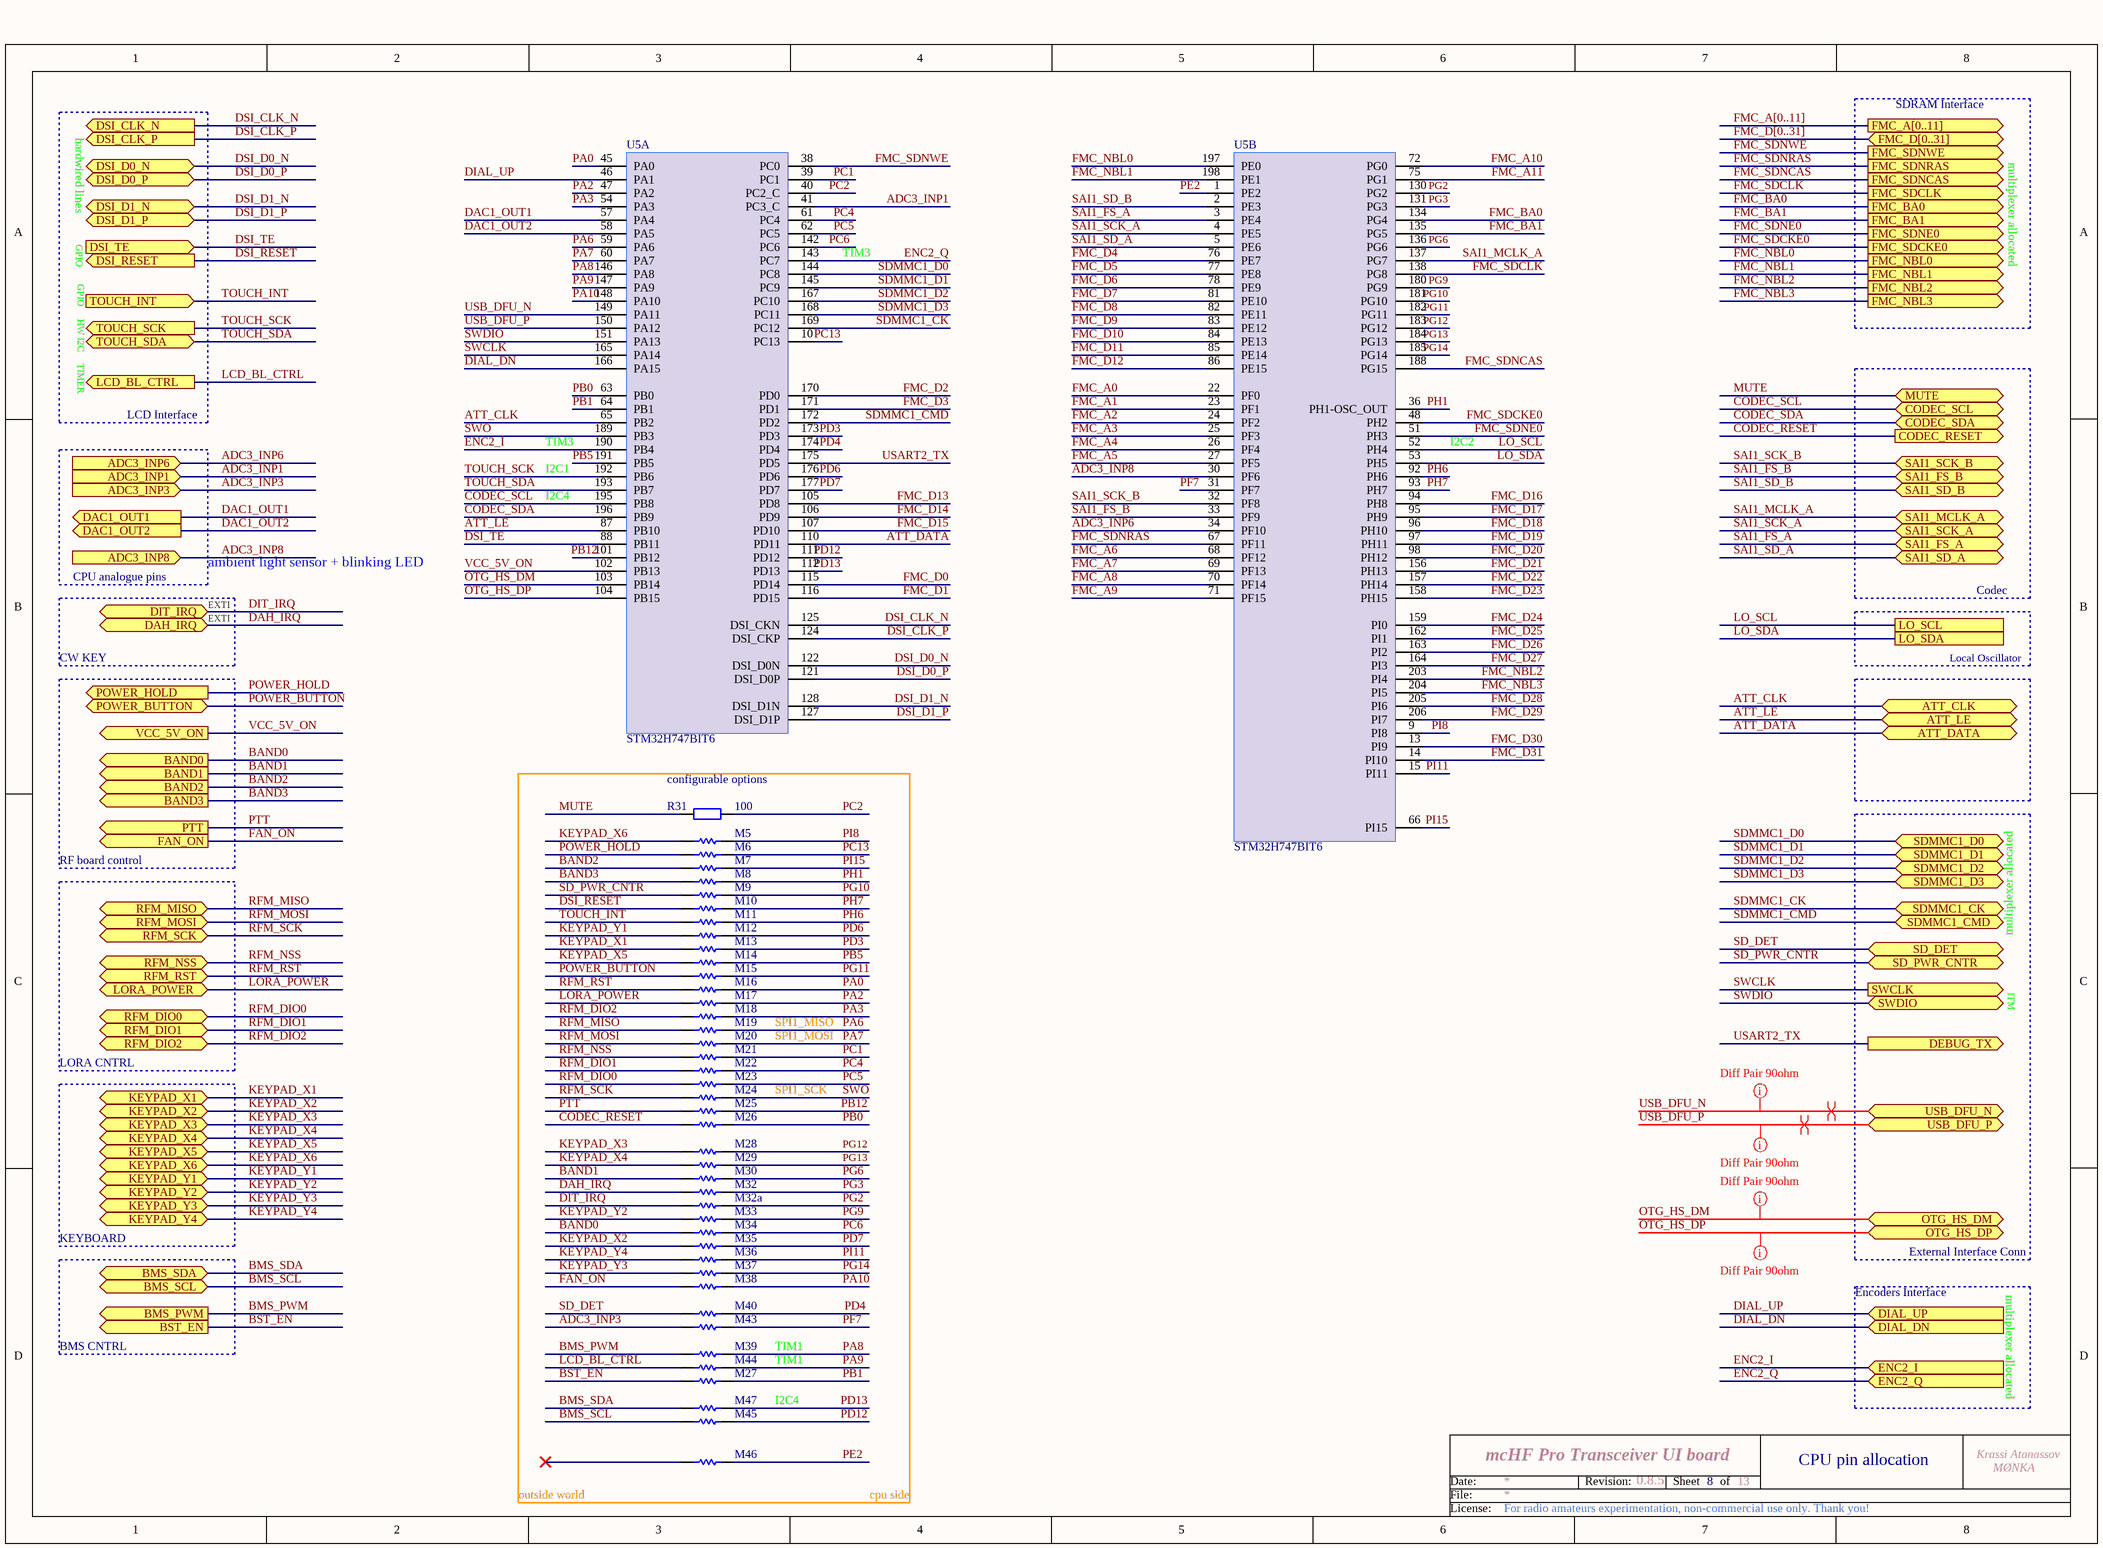
[diagram p3: ui_cpu.SchDoc]

### Parts
M5  0  [SB_0603]  (value not drawn)  (net tie, no BOM)
M6  0  [SB_0603]  (value not drawn)  (net tie, no BOM)
M7  0  [SB_0603]  (value not drawn)  (net tie, no BOM)
M8  0  [SB_0603]  (value not drawn)  (net tie, no BOM)
M9  0  [SB_0603]  (value not drawn)  (net tie, no BOM)
M10  0  [SB_0603]  (value not drawn)  (net tie, no BOM)
M11  0  [SB_0603]  (value not drawn)  (net tie, no BOM)
M12  0  [SB_0603]  (value not drawn)  (net tie, no BOM)
M13  0  [SB_0603]  (value not drawn)  (net tie, no BOM)
M14  0  [SB_0603]  (value not drawn)  (net tie, no BOM)
M15  0  [SB_0603]  (value not drawn)  (net tie, no BOM)
M16  0  [SB_0603]  (value not drawn)  (net tie, no BOM)
M17  0  [SB_0603]  (value not drawn)  (net tie, no BOM)
M18  0  [SB_0603]  (value not drawn)  (net tie, no BOM)
M19  0  [SB_0603]  (value not drawn)  (net tie, no BOM)
M20  0  [SB_0603]  (value not drawn)  (net tie, no BOM)
M21  0  [SB_0603]  (value not drawn)  (net tie, no BOM)
M22  0  [SB_0603]  (value not drawn)  (net tie, no BOM)
M23  0  [SB_0603]  (value not drawn)  (net tie, no BOM)
M24  0  [SB_0603]  (value not drawn)  (net tie, no BOM)
M25  0  [SB_0603]  (value not drawn)  (net tie, no BOM)
M26  0  [SB_0603]  (value not drawn)  (net tie, no BOM)
M27  0  [SB_0603]  (value not drawn)  (net tie, no BOM)
M28  0  [SB_0603]  (value not drawn)  (net tie, no BOM)
M29  0  [SB_0603]  (value not drawn)  (net tie, no BOM)
M30  0  [SB_0603]  (value not drawn)  (net tie, no BOM)
M32  0  [SB_0603]  (value not drawn)  (net tie, no BOM)
M32a  0  [SB_0603]  (value not drawn)  (net tie, no BOM)
M33  0  [SB_0603]  (value not drawn)  (net tie, no BOM)
M34  0  [SB_0603]  (value not drawn)  (net tie, no BOM)
M35  0  [SB_0603]  (value not drawn)  (net tie, no BOM)
M36  0  [SB_0603]  (value not drawn)  (net tie, no BOM)
M37  0  [SB_0603]  (value not drawn)  (net tie, no BOM)
M38  0  [SB_0603]  (value not drawn)  (net tie, no BOM)
M39  0  [SB_0603]  (value not drawn)  (net tie, no BOM)
M40  0  [SB_0603]  (value not drawn)  (net tie, no BOM)
M43  0  [SB_0603]  (value not drawn)  (net tie, no BOM)
M44  0  [SB_0603]  (value not drawn)  (net tie, no BOM)
M45  0  [SB_0603]  (value not drawn)  (net tie, no BOM)
M46  0  [SB_0603]  (value not drawn)  (net tie, no BOM)
M47  0  [SB_0603]  (value not drawn)  (net tie, no BOM)
R31  100  [0805]
U5  STM32H747BIT6  [LQFP208-28x28x1.4]  (parts A,B of 3)

### Ports
ADC3_INP1 (in), ADC3_INP3 (in), ADC3_INP6 (in), ADC3_INP8 (in), ATT_CLK (bidir), ATT_DATA (bidir), ATT_LE (bidir), BAND0 (out), BAND1 (out), BAND2 (out), BAND3 (out), BMS_PWM (out), BMS_SCL (bidir), BMS_SDA (bidir), BST_EN (out), CODEC_RESET (out), CODEC_SCL (bidir), CODEC_SDA (bidir), DAC1_OUT1 (out), DAC1_OUT2 (out), DAH_IRQ (bidir), DEBUG_TX (out), DIAL_DN (in), DIAL_UP (in), DIT_IRQ (bidir), DSI_CLK_N (out), DSI_CLK_P (out), DSI_D0_N (bidir), DSI_D0_P (bidir), DSI_D1_N (bidir), DSI_D1_P (bidir), DSI_RESET (out), DSI_TE (in), ENC2_I (in), ENC2_Q (in), FAN_ON (out), FMC_A[0..11] (out), FMC_BA0 (out), FMC_BA1 (out), FMC_D[0..31] (bidir), FMC_NBL0 (out), FMC_NBL1 (out), FMC_NBL2 (out), FMC_NBL3 (out), FMC_SDCKE0 (out), FMC_SDCLK (out), FMC_SDNCAS (out), FMC_SDNE0 (out), FMC_SDNRAS (out), FMC_SDNWE (out), KEYPAD_X1 (bidir), KEYPAD_X2 (bidir), KEYPAD_X3 (bidir), KEYPAD_X4 (bidir), KEYPAD_X5 (bidir), KEYPAD_X6 (bidir), KEYPAD_Y1 (bidir), KEYPAD_Y2 (bidir), KEYPAD_Y3 (bidir), KEYPAD_Y4 (bidir), LCD_BL_CTRL (out), LO_SCL, LO_SDA, LORA_POWER (bidir), MUTE (bidir), OTG_HS_DM (bidir), OTG_HS_DP (bidir), POWER_BUTTON (bidir), POWER_HOLD (out), PTT (out), RFM_DIO0 (bidir), RFM_DIO1 (bidir), RFM_DIO2 (bidir), RFM_MISO (bidir), RFM_MOSI (bidir), RFM_NSS (bidir), RFM_RST (bidir), RFM_SCK (bidir), SAI1_FS_A (bidir), SAI1_FS_B (bidir), SAI1_MCLK_A (bidir), SAI1_SCK_A (bidir), SAI1_SCK_B (bidir), SAI1_SD_A (bidir), SAI1_SD_B (bidir), SD_DET (bidir), SD_PWR_CNTR (bidir), SDMMC1_CK (bidir), SDMMC1_CMD (bidir), SDMMC1_D0 (bidir), SDMMC1_D1 (bidir), SDMMC1_D2 (bidir), SDMMC1_D3 (bidir), SWCLK (out), SWDIO (bidir), TOUCH_INT (in), TOUCH_SCK (out), TOUCH_SDA (bidir), USB_DFU_N (bidir), USB_DFU_P (bidir), VCC_5V_ON (out)

### Nets
ADC3_INP1: U5.41(PC3_C) ; port ADC3_INP1
ADC3_INP3: M43.1 ; port ADC3_INP3
ADC3_INP6: U5.34(PF10) ; port ADC3_INP6
ADC3_INP8: U5.30(PF6) ; port ADC3_INP8
ATT_CLK: U5.65(PB2) ; port ATT_CLK
ATT_DATA: U5.110(PD11) ; port ATT_DATA
ATT_LE: U5.87(PB10) ; port ATT_LE
BAND0: M34.1 ; port BAND0
BAND1: M30.1 ; port BAND1
BAND2: M7.1 ; port BAND2
BAND3: M8.1 ; port BAND3
BMS_PWM: M39.1 ; port BMS_PWM
BMS_SCL: M45.1 ; port BMS_SCL
BMS_SDA: M47.1 ; port BMS_SDA
BST_EN: M27.1 ; port BST_EN
CODEC_RESET: M26.1 ; port CODEC_RESET
CODEC_SCL: U5.195(PB8) ; port CODEC_SCL
CODEC_SDA: U5.196(PB9) ; port CODEC_SDA
DAC1_OUT1: U5.57(PA4) ; port DAC1_OUT1
DAC1_OUT2: U5.58(PA5) ; port DAC1_OUT2
DAH_IRQ: M32.1 ; port DAH_IRQ
DIAL_DN: U5.166(PA15) ; port DIAL_DN
DIAL_UP: U5.46(PA1) ; port DIAL_UP
DIT_IRQ: M32a.1 ; port DIT_IRQ
DSI_CLK_N: U5.125(DSI_CKN) ; port DSI_CLK_N
DSI_CLK_P: U5.124(DSI_CKP) ; port DSI_CLK_P
DSI_D0_N: U5.122(DSI_D0N) ; port DSI_D0_N
DSI_D0_P: U5.121(DSI_D0P) ; port DSI_D0_P
DSI_D1_N: U5.128(DSI_D1N) ; port DSI_D1_N
DSI_D1_P: U5.127(DSI_D1P) ; port DSI_D1_P
DSI_RESET: M10.1 ; port DSI_RESET
DSI_TE: U5.88(PB11) ; port DSI_TE
ENC2_I: U5.190(PB4) ; port ENC2_I
ENC2_Q: U5.143(PC7) ; port ENC2_Q
FAN_ON: M38.1 ; port FAN_ON
FMC_A0: U5.22(PF0)
FMC_A1: U5.23(PF1)
FMC_A2: U5.24(PF2)
FMC_A3: U5.25(PF3)
FMC_A4: U5.26(PF4)
FMC_A5: U5.27(PF5)
FMC_A6: U5.68(PF12)
FMC_A7: U5.69(PF13)
FMC_A8: U5.70(PF14)
FMC_A9: U5.71(PF15)
FMC_A10: U5.72(PG0)
FMC_A11: U5.75(PG1)
FMC_BA0: U5.134(PG4) ; port FMC_BA0
FMC_BA1: U5.135(PG5) ; port FMC_BA1
FMC_D0: U5.115(PD14)
FMC_D1: U5.116(PD15)
FMC_D2: U5.170(PD0)
FMC_D3: U5.171(PD1)
FMC_D4: U5.76(PE7)
FMC_D5: U5.77(PE8)
FMC_D6: U5.78(PE9)
FMC_D7: U5.81(PE10)
FMC_D8: U5.82(PE11)
FMC_D9: U5.83(PE12)
FMC_D10: U5.84(PE13)
FMC_D11: U5.85(PE14)
FMC_D12: U5.86(PE15)
FMC_D13: U5.105(PD8)
FMC_D14: U5.106(PD9)
FMC_D15: U5.107(PD10)
FMC_D16: U5.94(PH8)
FMC_D17: U5.95(PH9)
FMC_D18: U5.96(PH10)
FMC_D19: U5.97(PH11)
FMC_D20: U5.98(PH12)
FMC_D21: U5.156(PH13)
FMC_D22: U5.157(PH14)
FMC_D23: U5.158(PH15)
FMC_D24: U5.159(PI0)
FMC_D25: U5.162(PI1)
FMC_D26: U5.163(PI2)
FMC_D27: U5.164(PI3)
FMC_D28: U5.205(PI6)
FMC_D29: U5.206(PI7)
FMC_D30: U5.13(PI9)
FMC_D31: U5.14(PI10)
FMC_NBL0: U5.197(PE0) ; port FMC_NBL0
FMC_NBL1: U5.198(PE1) ; port FMC_NBL1
FMC_NBL2: U5.203(PI4) ; port FMC_NBL2
FMC_NBL3: U5.204(PI5) ; port FMC_NBL3
FMC_SDCKE0: U5.48(PH2) ; port FMC_SDCKE0
FMC_SDCLK: U5.138(PG8) ; port FMC_SDCLK
FMC_SDNCAS: U5.188(PG15) ; port FMC_SDNCAS
FMC_SDNE0: U5.51(PH3) ; port FMC_SDNE0
FMC_SDNRAS: U5.67(PF11) ; port FMC_SDNRAS
FMC_SDNWE: U5.38(PC0) ; port FMC_SDNWE
KEYPAD_X1: M13.1 ; port KEYPAD_X1
KEYPAD_X2: M35.1 ; port KEYPAD_X2
KEYPAD_X3: M28.1 ; port KEYPAD_X3
KEYPAD_X4: M29.1 ; port KEYPAD_X4
KEYPAD_X5: M14.1 ; port KEYPAD_X5
KEYPAD_X6: M5.1 ; port KEYPAD_X6
KEYPAD_Y1: M12.1 ; port KEYPAD_Y1
KEYPAD_Y2: M33.1 ; port KEYPAD_Y2
KEYPAD_Y3: M37.1 ; port KEYPAD_Y3
KEYPAD_Y4: M36.1 ; port KEYPAD_Y4
LCD_BL_CTRL: M44.1 ; port LCD_BL_CTRL
LO_SCL: U5.52(PH4) ; port LO_SCL
LO_SDA: U5.53(PH5) ; port LO_SDA
LORA_POWER: M17.1 ; port LORA_POWER
MUTE: R31.2 ; port MUTE
OTG_HS_DM: U5.103(PB14) ; port OTG_HS_DM
OTG_HS_DP: U5.104(PB15) ; port OTG_HS_DP
PA0: M16.2 U5.45(PA0)
PA2: M17.2 U5.47(PA2)
PA3: M18.2 U5.54(PA3)
PA6: M19.2 U5.59(PA6)
PA7: M20.2 U5.60(PA7)
PA8: M39.2 U5.146(PA8)
PA9: M44.2 U5.147(PA9)
PA10: M38.2 U5.148(PA10)
PB0: M26.2 U5.63(PB0)
PB1: M27.2 U5.64(PB1)
PB5: M14.2 U5.191(PB5)
PB12: M25.2 U5.101(PB12)
PC1: M21.2 U5.39(PC1)
PC2: R31.1 U5.40(PC2_C)
PC4: M22.2 U5.61(PC4)
PC5: M23.2 U5.62(PC5)
PC6: M34.2 U5.142(PC6)
PC13: M6.2 U5.10(PC13)
PD3: M13.2 U5.173(PD3)
PD4: M40.2 U5.174(PD4)
PD6: M12.2 U5.176(PD6)
PD7: M35.2 U5.177(PD7)
PD12: M45.2 U5.111(PD12)
PD13: M47.2 U5.112(PD13)
PE2: M46.2 U5.1(PE2)
PF7: M43.2 U5.31(PF7)
PG2: M32a.2 U5.130(PG2)
PG3: M32.2 U5.131(PG3)
PG6: M30.2 U5.136(PG6)
PG9: M33.2 U5.180(PG9)
PG10: M9.2 U5.181(PG10)
PG11: M15.2 U5.182(PG11)
PG12: M28.2 U5.183(PG12)
PG13: M29.2 U5.184(PG13)
PG14: M37.2 U5.185(PG14)
PH1: M8.2 U5.36(PH1-OSC_OUT)
PH6: M11.2 U5.92(PH6)
PH7: M10.2 U5.93(PH7)
PI8: M5.2 U5.9(PI8)
PI11: M36.2 U5.15(PI11)
PI15: M7.2 U5.66(PI15)
POWER_BUTTON: M15.1 ; port POWER_BUTTON
POWER_HOLD: M6.1 ; port POWER_HOLD
PTT: M25.1 ; port PTT
RFM_DIO0: M23.1 ; port RFM_DIO0
RFM_DIO1: M22.1 ; port RFM_DIO1
RFM_DIO2: M18.1 ; port RFM_DIO2
RFM_MISO: M19.1 ; port RFM_MISO
RFM_MOSI: M20.1 ; port RFM_MOSI
RFM_NSS: M21.1 ; port RFM_NSS
RFM_RST: M16.1 ; port RFM_RST
RFM_SCK: M24.1 ; port RFM_SCK
SAI1_FS_A: U5.3(PE4) ; port SAI1_FS_A
SAI1_FS_B: U5.33(PF9) ; port SAI1_FS_B
SAI1_MCLK_A: U5.137(PG7) ; port SAI1_MCLK_A
SAI1_SCK_A: U5.4(PE5) ; port SAI1_SCK_A
SAI1_SCK_B: U5.32(PF8) ; port SAI1_SCK_B
SAI1_SD_A: U5.5(PE6) ; port SAI1_SD_A
SAI1_SD_B: U5.2(PE3) ; port SAI1_SD_B
SD_DET: M40.1 ; port SD_DET
SD_PWR_CNTR: M9.1 ; port SD_PWR_CNTR
SDMMC1_CK: U5.169(PC12) ; port SDMMC1_CK
SDMMC1_CMD: U5.172(PD2) ; port SDMMC1_CMD
SDMMC1_D0: U5.144(PC8) ; port SDMMC1_D0
SDMMC1_D1: U5.145(PC9) ; port SDMMC1_D1
SDMMC1_D2: U5.167(PC10) ; port SDMMC1_D2
SDMMC1_D3: U5.168(PC11) ; port SDMMC1_D3
SWCLK: U5.165(PA14) ; port SWCLK
SWDIO: U5.151(PA13) ; port SWDIO
SWO: M24.2 U5.189(PB3)
TOUCH_INT: M11.1 ; port TOUCH_INT
TOUCH_SCK: U5.192(PB6) ; port TOUCH_SCK
TOUCH_SDA: U5.193(PB7) ; port TOUCH_SDA
USART2_TX: U5.175(PD5) ; port DEBUG_TX
USB_DFU_N: U5.149(PA11) ; port USB_DFU_N
USB_DFU_P: U5.150(PA12) ; port USB_DFU_P
VCC_5V_ON: U5.102(PB13) ; port VCC_5V_ON

Not connected (* = marked no-connect by the designer): M46 1*

### Buses and harness runs
bus FMC_A[0..11] = port FMC_A[0..11]
bus FMC_D[0..31] = port FMC_D[0..31]

### Layout directives
differential pair: USB_DFU_N, USB_DFU_P
rule Matched Net Lengths [Tolerance = 300mil]: OTG_HS_DM, OTG_HS_DP, USB_DFU_N, USB_DFU_P

### Notes on the sheet
- hardwired lines
- SDRAM Interface
- multiplexer allocated
- GPIO
- TIM3
- HW I2C
- TIMER
- LCD Interface
- I2C1
- I2C2
- I2C4
- CPU analogue pins
- EXTI
- ambient light sensor + blinking LED
- Codec
- CW KEY
- Local Oscillator
- (near R31) configurable options
- RF board control
- SPI1_MISO
- ITM
- LORA CNTRL
- SPI1_SCK
- SPI1_MOSI
- KEYBOARD
- Encoders Interface
- External Interface Conn
- BMS CNTRL
- TIM1
- outside world
- cpu side
- 8
- CPU pin allocation
- Date:
- File:
- Revision:
- Sheet
- of
- License:

### Library data of the parts
M5-M30 M32 M32a M33-M40 M43-M47 = Link: Value: 1K; Published: 8-Jun-2000; Revision: July-2002: Re-released for DXP Platform.; Publisher: Altium Limited
R31 = RES: Resistor; Order: FN 933-2375; QT Order: QCR-00301; Price: 0.027
U5 = STM32H747BIT6: STM32H747BIT6 LQFP208; Order: FN 248-4976; Price: 10.97

## Sheet ui_sdram.SchDoc: mcHF Pro Transceiver UI board
size A3; Author: Krassi Atanassov; CompanyName: MØNKA; Engineer: For radio amateurs experimentation, non-commercial use only. Thank you!; Revision: 0.8.2; SheetTotal: 18
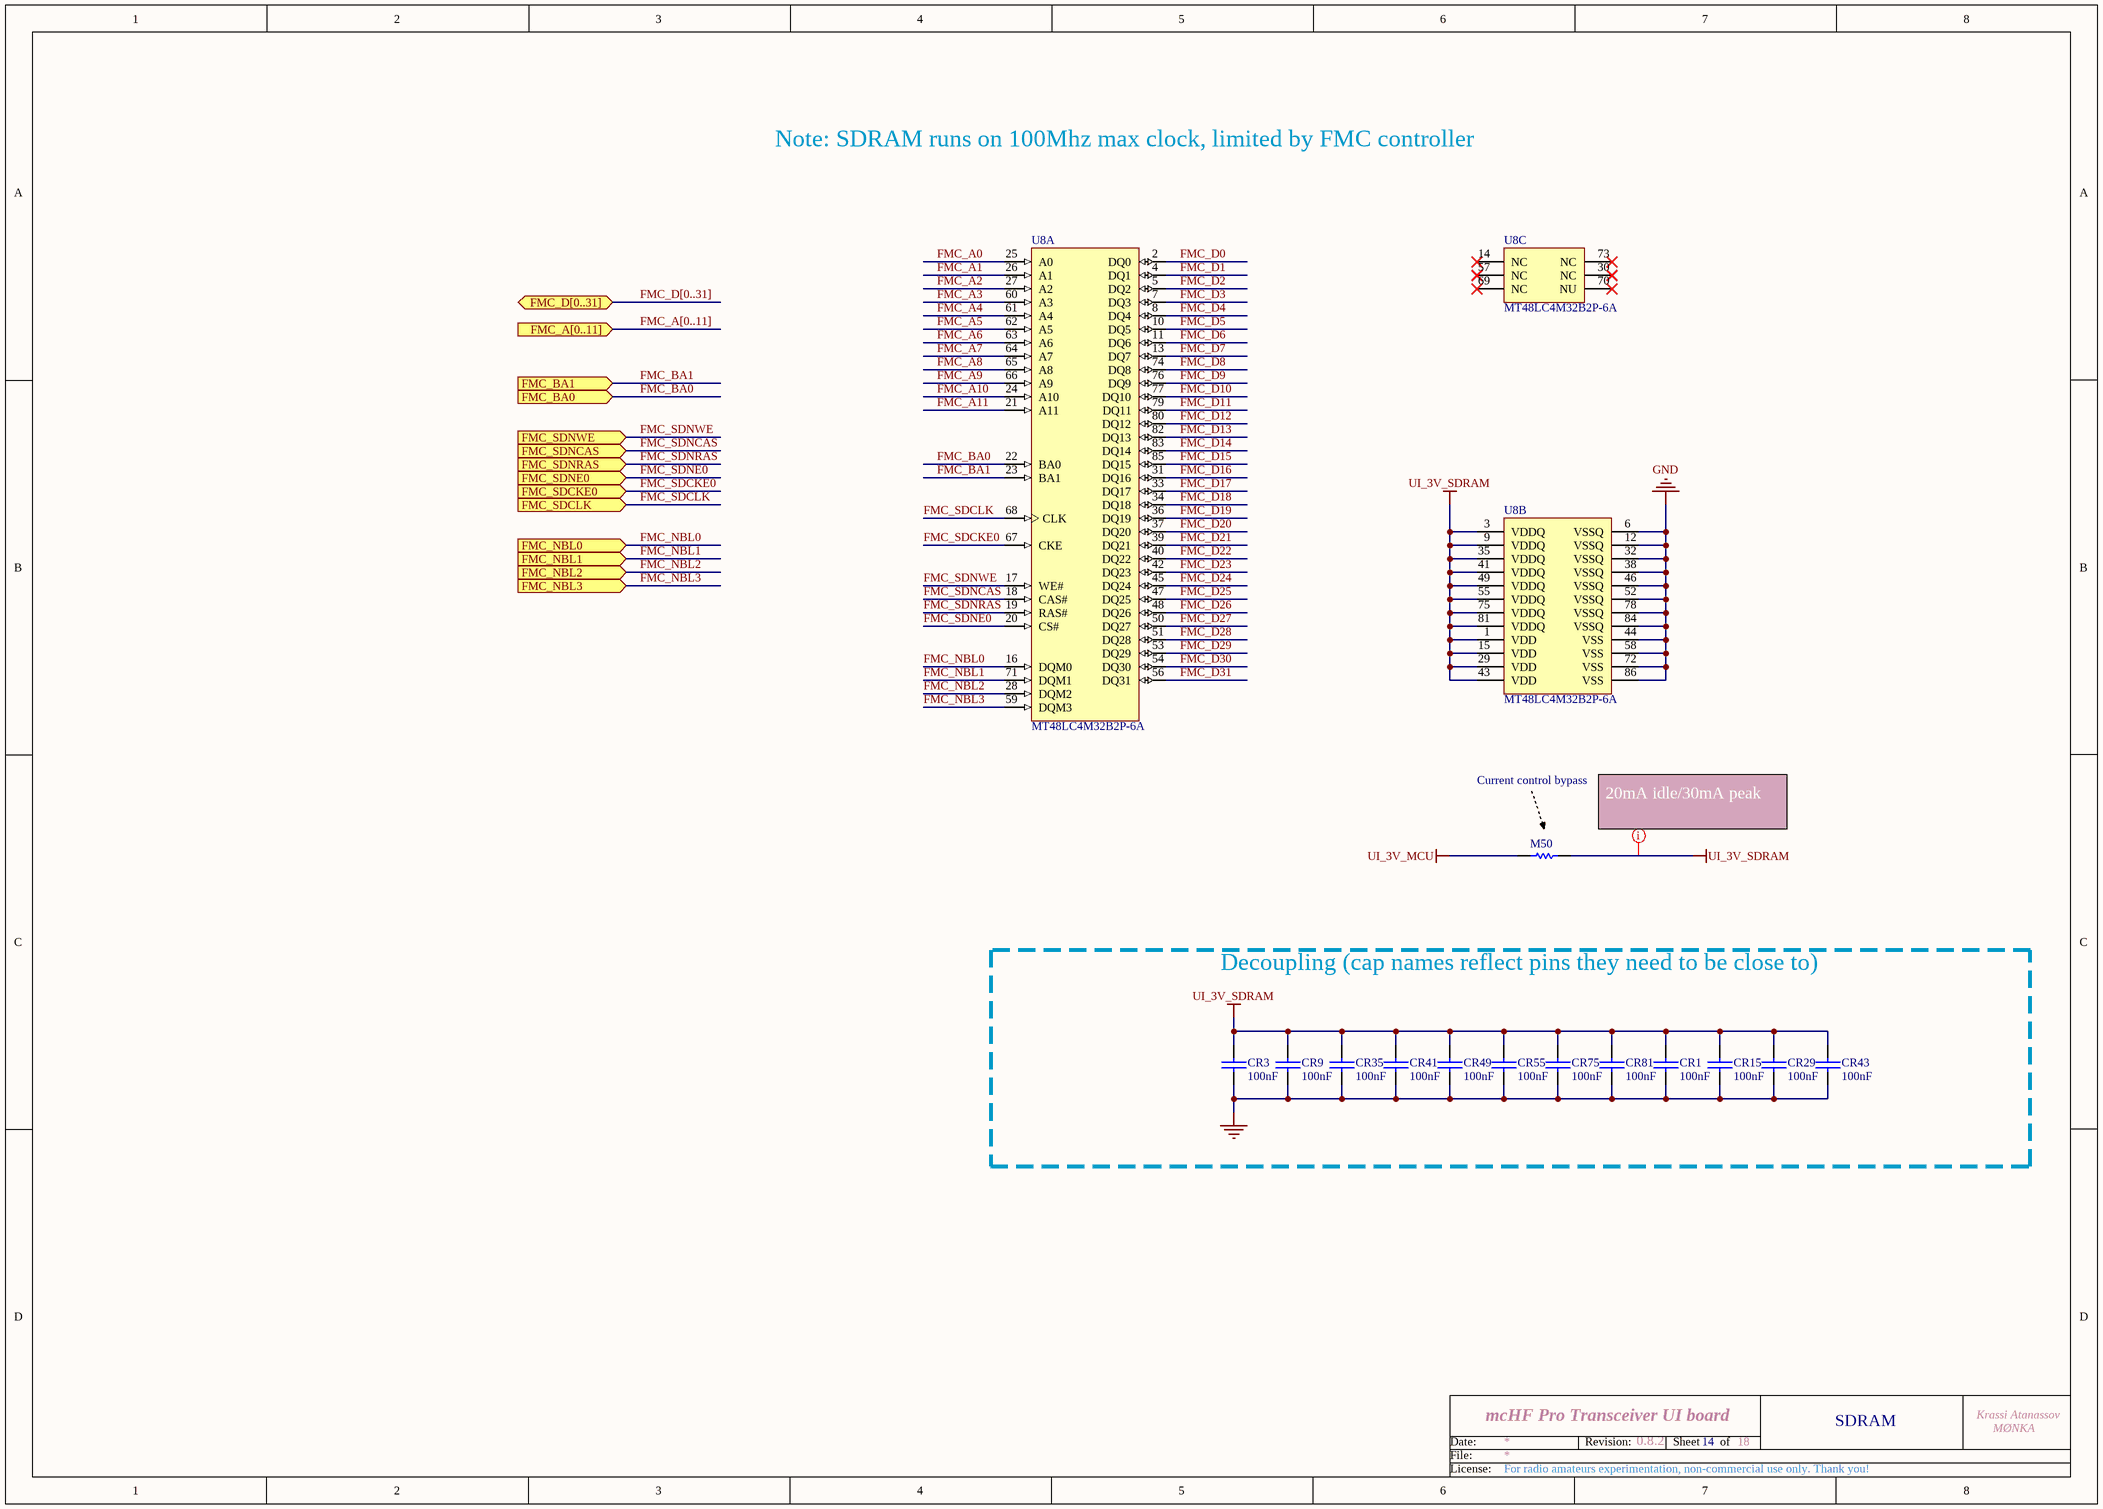
[diagram p4: ui_sdram.SchDoc]

### Parts
CR1  100nF  [0805]
CR3  100nF  [0805]
CR9  100nF  [0805]
CR15  100nF  [0805]
CR29  100nF  [0805]
CR35  100nF  [0805]
CR41  100nF  [0805]
CR43  100nF  [0805]
CR49  100nF  [0805]
CR55  100nF  [0805]
CR75  100nF  [0805]
CR81  100nF  [0805]
M50  0  [SB_0603]  (value not drawn)  (net tie, no BOM)
U8  MT48LC4M32B2P-6A  [MICT-TG-86_N]  (parts A,B,C of 3)

### Blocks framed on the sheet
Decoupling (cap names reflect pins they need to be close to): CR1 CR3 CR9 CR15 CR29 CR35 CR41 CR43 CR49 CR55 CR75 CR81

### Ports
FMC_A[0..11] (in), FMC_BA0 (in), FMC_BA1 (in), FMC_D[0..31] (bidir), FMC_NBL0 (in), FMC_NBL1 (in), FMC_NBL2 (in), FMC_NBL3 (in), FMC_SDCKE0 (in), FMC_SDCLK (in), FMC_SDNCAS (in), FMC_SDNE0 (in), FMC_SDNRAS (in), FMC_SDNWE (in)

### Nets
GND: CR1.2 CR3.2 CR9.2 CR15.2 CR29.2 CR35.2 CR41.2 CR43.2 CR49.2 CR55.2 CR75.2 CR81.2 U8.6(VSSQ) U8.12(VSSQ) U8.32(VSSQ) U8.38(VSSQ) U8.44(VSS) U8.46(VSSQ) U8.52(VSSQ) U8.58(VSS) U8.72(VSS) U8.78(VSSQ) U8.84(VSSQ) U8.86(VSS)
UI_3V_MCU: M50.1
UI_3V_SDRAM: CR1.1 CR3.1 CR9.1 CR15.1 CR29.1 CR35.1 CR41.1 CR43.1 CR49.1 CR55.1 CR75.1 CR81.1 M50.2 U8.1(VDD) U8.3(VDDQ) U8.9(VDDQ) U8.15(VDD) U8.29(VDD) U8.35(VDDQ) U8.41(VDDQ) U8.43(VDD) U8.49(VDDQ) U8.55(VDDQ) U8.75(VDDQ) U8.81(VDDQ)
FMC_A0: U8.25(A0)
FMC_A1: U8.26(A1)
FMC_A2: U8.27(A2)
FMC_A3: U8.60(A3)
FMC_A4: U8.61(A4)
FMC_A5: U8.62(A5)
FMC_A6: U8.63(A6)
FMC_A7: U8.64(A7)
FMC_A8: U8.65(A8)
FMC_A9: U8.66(A9)
FMC_A10: U8.24(A10)
FMC_A11: U8.21(A11)
FMC_BA0: U8.22(BA0) ; port FMC_BA0
FMC_BA1: U8.23(BA1) ; port FMC_BA1
FMC_D0: U8.2(DQ0)
FMC_D1: U8.4(DQ1)
FMC_D2: U8.5(DQ2)
FMC_D3: U8.7(DQ3)
FMC_D4: U8.8(DQ4)
FMC_D5: U8.10(DQ5)
FMC_D6: U8.11(DQ6)
FMC_D7: U8.13(DQ7)
FMC_D8: U8.74(DQ8)
FMC_D9: U8.76(DQ9)
FMC_D10: U8.77(DQ10)
FMC_D11: U8.79(DQ11)
FMC_D12: U8.80(DQ12)
FMC_D13: U8.82(DQ13)
FMC_D14: U8.83(DQ14)
FMC_D15: U8.85(DQ15)
FMC_D16: U8.31(DQ16)
FMC_D17: U8.33(DQ17)
FMC_D18: U8.34(DQ18)
FMC_D19: U8.36(DQ19)
FMC_D20: U8.37(DQ20)
FMC_D21: U8.39(DQ21)
FMC_D22: U8.40(DQ22)
FMC_D23: U8.42(DQ23)
FMC_D24: U8.45(DQ24)
FMC_D25: U8.47(DQ25)
FMC_D26: U8.48(DQ26)
FMC_D27: U8.50(DQ27)
FMC_D28: U8.51(DQ28)
FMC_D29: U8.53(DQ29)
FMC_D30: U8.54(DQ30)
FMC_D31: U8.56(DQ31)
FMC_NBL0: U8.16(DQM0) ; port FMC_NBL0
FMC_NBL1: U8.71(DQM1) ; port FMC_NBL1
FMC_NBL2: U8.28(DQM2) ; port FMC_NBL2
FMC_NBL3: U8.59(DQM3) ; port FMC_NBL3
FMC_SDCKE0: U8.67(CKE) ; port FMC_SDCKE0
FMC_SDCLK: U8.68(CLK) ; port FMC_SDCLK
FMC_SDNCAS: U8.18(CAS#) ; port FMC_SDNCAS
FMC_SDNE0: U8.20(CS#) ; port FMC_SDNE0
FMC_SDNRAS: U8.19(RAS#) ; port FMC_SDNRAS
FMC_SDNWE: U8.17(WE#) ; port FMC_SDNWE

Not connected (* = marked no-connect by the designer): U8 14(NC)* 30(NC)* 57(NC)* 69(NC)* 70(NU)* 73(NC)*

### Buses and harness runs
bus FMC_A[0..11] = port FMC_A[0..11]
bus FMC_D[0..31] = port FMC_D[0..31]

### Layout directives
rule Width Constraint [Pref Width = 12mil    Min Width = 12mil    Max Width = 12mil]: UI_3V_SDRAM

### Notes on the sheet
- Note: SDRAM runs on 100Mhz max clock, limited by FMC controller
- Current control bypass
- (near M50) 20mA idle/30mA peak
- 14
- SDRAM
- Date:
- File:
- Revision:
- Sheet
- of
- License:

### Library data of the parts
CR1 CR3 CR9 CR15 CR29 CR35 CR41 CR43 CR49 CR55 CR75 CR81 = CAP: as C29 on sheet ui_front; Price: 0.089
M50 = Link: Value: 1K; Published: 8-Jun-2000; Revision: July-2002: Re-released for DXP Platform.; Publisher: Altium Limited
U8 = MT48LC4M32B2P-6A: 128Mb PC133 SDR SDRAM, 4Mb x 32, 6ns, 3.3V, 0 to 70 degC, 86-Pin TSOP; Order: FN 225-3746; Price: 8.55

## Sheet ui_lcd.SchDoc: mcHF Pro Transceiver UI board
size A3; Author: Krassi Atanassov; CompanyName: MØNKA; Engineer: For radio amateurs experimentation, non-commercial use only. Thank you!; Revision: 0.8.5; SheetTotal: 13
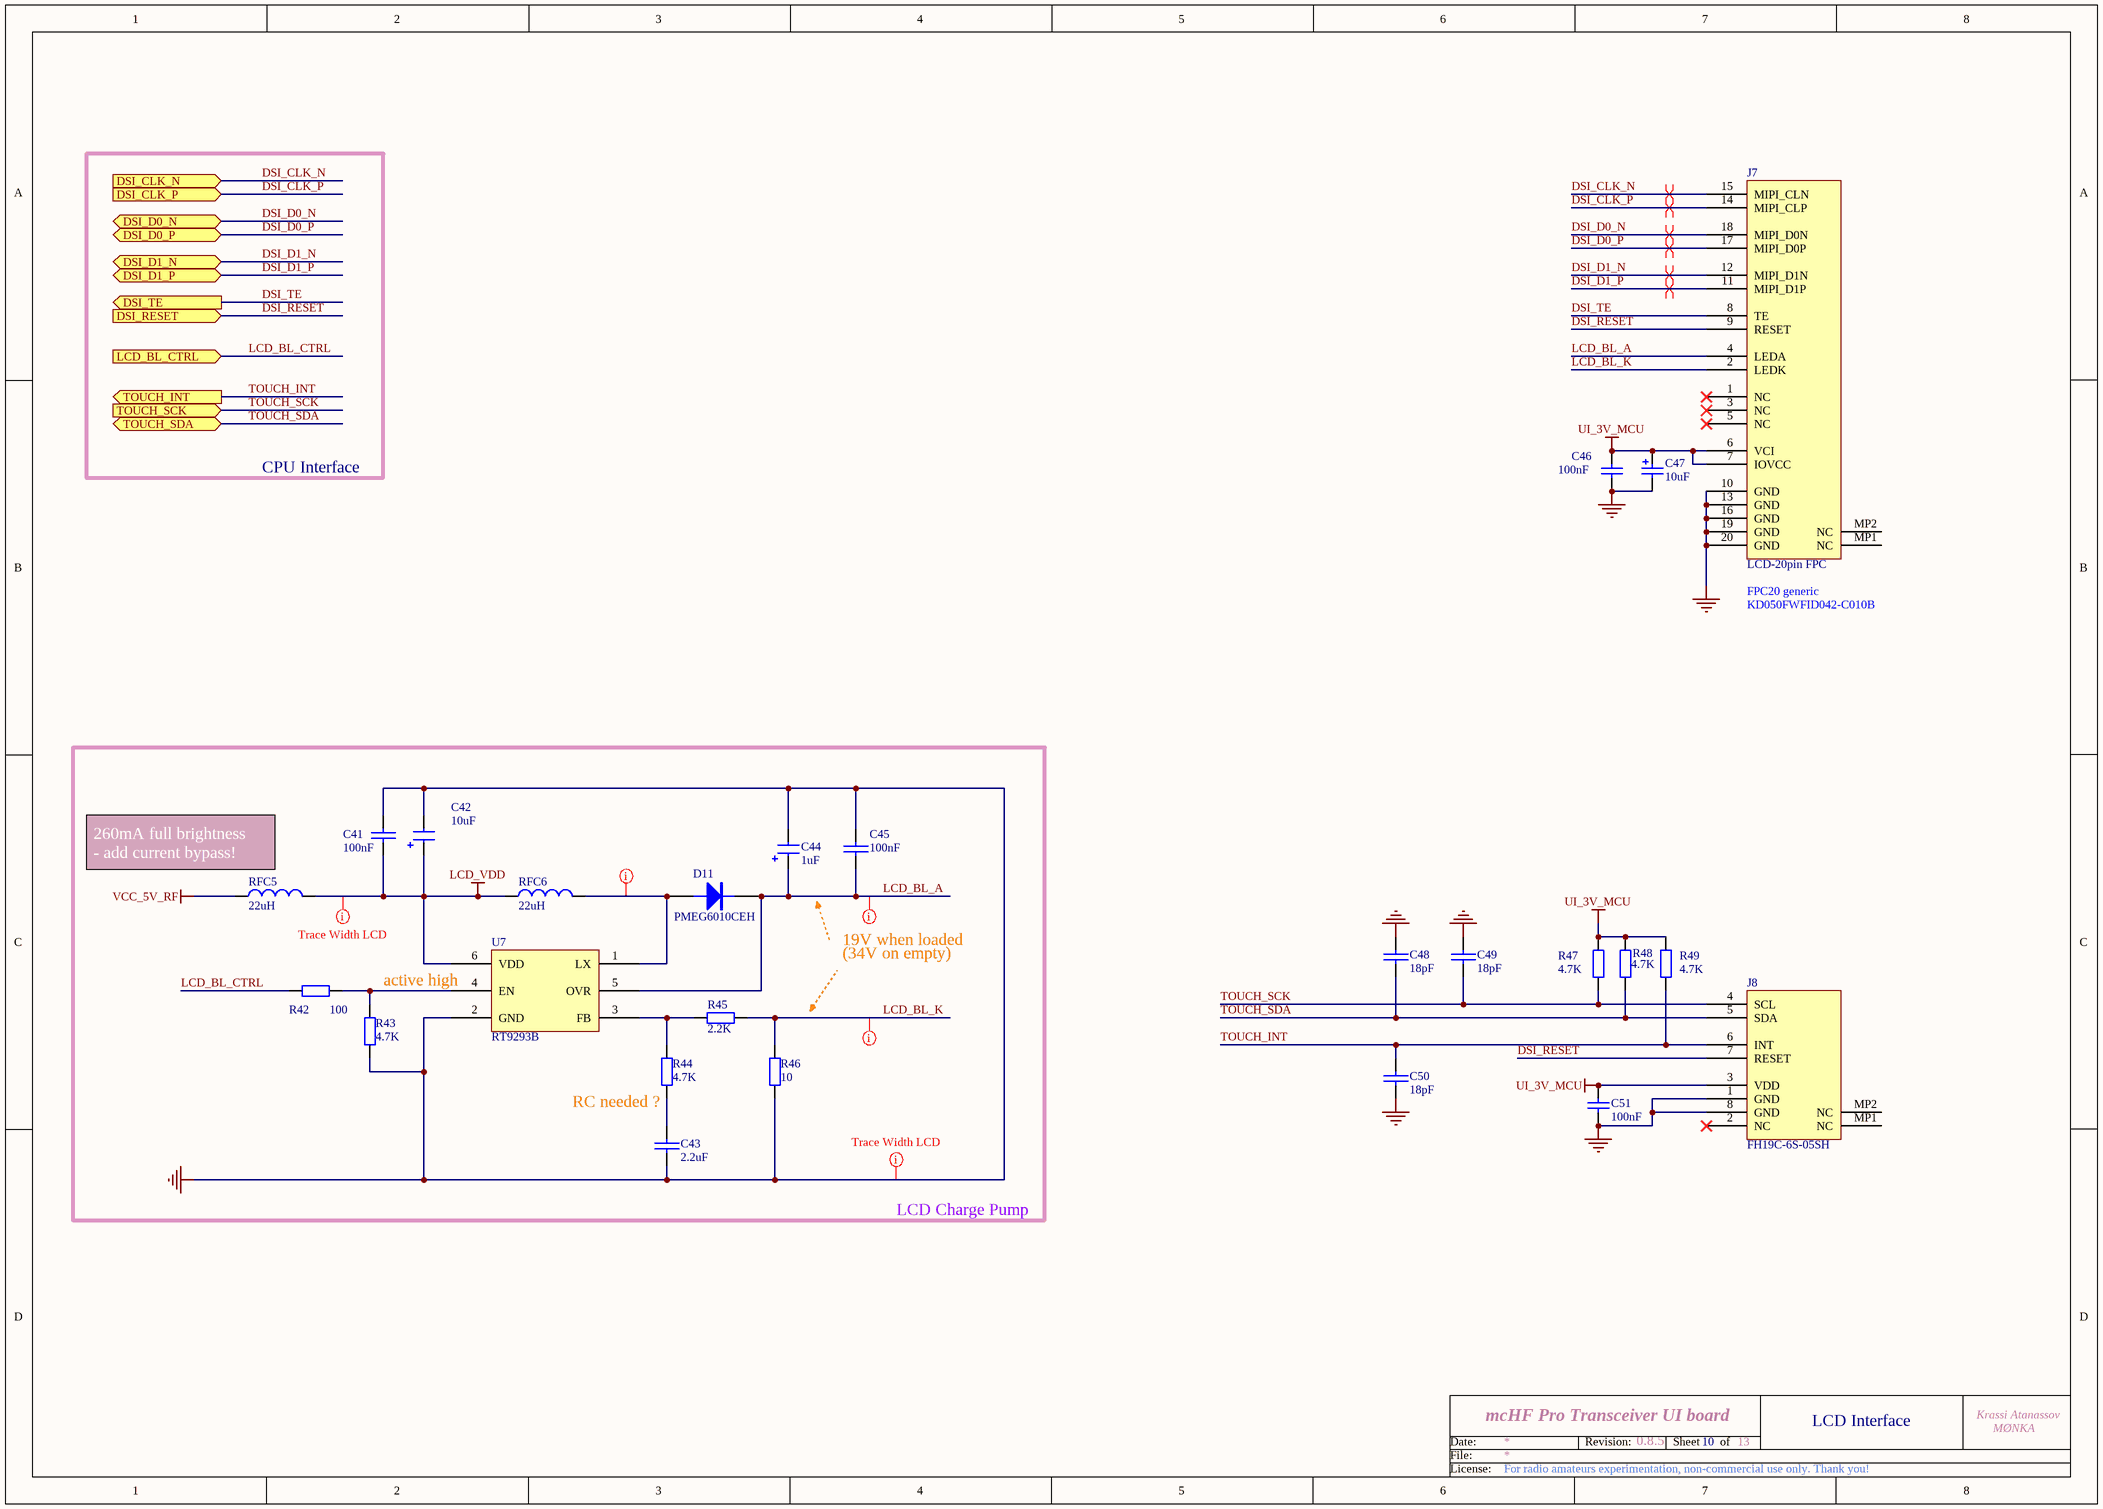
[diagram p5: ui_lcd.SchDoc]

### Parts
C41  100nF  [0805]
C42  10uF  [1206_Elec_Cap]
C43  2.2uF  [0805]
C44  1uF  [1206_Elec_Cap]
C45  100nF  [0805]
C46  100nF  [0805]
C47  10uF  [1206_Elec_Cap]
C48  18pF  [0805]
C49  18pF  [0805]
C50  18pF  [0805]
C51  100nF  [0805]
D11  PMEG6010CEH  [SOD87]
J7  LCD-20pin FPC  [MOLX-52746-2071]
J8  FH19C-6S-05SH  [MOLX-501461-0891]
R42  100  [0805]
R43  4.7K  [0805]
R44  4.7K  [0805]
R45  2.2K  [0805]
R46  10  [1206]
R47  4.7K  [0805]
R48  4.7K  [0805]
R49  4.7K  [0805]
RFC5  22uH  [0805]
RFC6  22uH  [0805]
U7  RT9293B  [SOT25-6]

### Ports
DSI_CLK_N (in), DSI_CLK_P (in), DSI_D0_N (bidir), DSI_D0_P (bidir), DSI_D1_N (bidir), DSI_D1_P (bidir), DSI_RESET (in), DSI_TE (out), LCD_BL_CTRL (in), TOUCH_INT (out), TOUCH_SCK (in), TOUCH_SDA (bidir)

### Nets
GND: C41.1 C42.2 C43.2 C44.2 C45.1 C46.1 C47.2 C48.1 C49.1 C50.2 C51.1 J7.10(GND) J7.13(GND) J7.16(GND) J7.19(GND) J7.20(GND) J8.1(GND) J8.8(GND) R43.1 R46.1 U7.2(GND)
LCD_VDD: C41.2 C42.1 RFC5.2 RFC6.1 U7.6(VDD)
UI_3V_MCU: C46.2 C47.1 C51.2 J7.6(VCI) J7.7(IOVCC) J8.3(VDD) R47.1 R48.1 R49.1
VCC_5V_RF: RFC5.1
DSI_CLK_N: J7.15(MIPI_CLN) ; port DSI_CLK_N
DSI_CLK_P: J7.14(MIPI_CLP) ; port DSI_CLK_P
DSI_D0_N: J7.18(MIPI_D0N) ; port DSI_D0_N
DSI_D0_P: J7.17(MIPI_D0P) ; port DSI_D0_P
DSI_D1_N: J7.12(MIPI_D1N) ; port DSI_D1_N
DSI_D1_P: J7.11(MIPI_D1P) ; port DSI_D1_P
DSI_RESET: J7.9(RESET) J8.7(RESET) ; port DSI_RESET
DSI_TE: J7.8(TE) ; port DSI_TE
LCD_BL_A: C44.1 C45.2 D11.2(K) J7.4(LEDA) U7.5(OVR)
LCD_BL_CTRL: R42.1 ; port LCD_BL_CTRL
LCD_BL_K: J7.2(LEDK) R45.2 R46.2
TOUCH_INT: C50.1 J8.6(INT) R49.2 ; port TOUCH_INT
TOUCH_SCK: C49.2 J8.4(SCL) R47.2 ; port TOUCH_SCK
TOUCH_SDA: C48.2 J8.5(SDA) R48.2 ; port TOUCH_SDA
NetC43_1: C43.1 R44.1
NetD11_1: D11.1(A) RFC6.2 U7.1(LX)
NetR42_2: R42.2 R43.2 U7.4(EN)
NetR44_2: R44.2 R45.1 U7.3(FB)

Not connected (* = marked no-connect by the designer): J7 1(NC)* 3(NC)* 5(NC)* MP1(NC) MP2(NC); J8 2(NC)* MP1(NC) MP2(NC)

### Layout directives
rule Width Constraint [Pref Width = 20mil    Min Width = 20mil    Max Width = 20mil]: GND, LCD_VDD
rule Width Constraint [Pref Width = 15mil    Min Width = 15mil    Max Width = 15mil]: NetD11_1
rule Width Constraint [Pref Width = 10mil    Min Width = 10mil    Max Width = 10mil]: LCD_BL_A, LCD_BL_K
differential pair: DSI_CLK_N, DSI_CLK_P, DSI_D0_N, DSI_D0_P, DSI_D1_N, DSI_D1_P

### Notes on the sheet
- CPU Interface
- KD050FWFID042-C010B
- (near J7) FPC20 generic
- (near RFC5) 260mA full brightness     - add current bypass!
- (near U7) active high
- 19V when loaded
- (34V on empty)
- (near R44) RC needed ?
- LCD Charge Pump
- 10
- LCD Interface
- Date:
- File:
- Revision:
- Sheet
- of
- License:

### Library data of the parts
C41 C45 = CAP: as C29 on sheet ui_front; Price: 0.089
C42 = CAP-POL: Electrolitic capacitor; Order: FN 145-7414; QT Order: QCC-00166; Price: 0.30
C43 = CAP: Ceramic Capacitor; Order: FN 175-9477; QT Order: QCC-00447; Price: 0.114
C44 = CAP-POL: Electrolitic capacitor; Order: FN 145-7406; QT Order: QCC-00172; Voltage: 50V; Price: 0.235
C46 C51 = CAP: Capacitor; Value: 100pF; Published: 8-Jun-2000; Revision: July-2002: Re-released for DXP Platform.; Publisher: Altium Limited
C47 = Cap Pol1: Published: 8-Jun-2000; Revision: July-2002: Re-released for DXP Platform.; Publisher: Altium Limited
C48-C50 = CAP: Capacitor; Notes: COG/NPO; Voltage: 100V
D11 = PMEG6010CEH: DIODE, SCHOTTKY, 1A, 60V, SOD-123F; Order: FN 151-0694; QT Order: QCD-00034; QT Price: 0.08; Price: 0.262
J7 = KD050FWFID042-C010B: LCD-20pin FPC, Top contacts position; Order: FN 3215802; Notes: FPC Board Connector, 0.5 mm, 20 Contacts, Receptacle, Top contacts position!
J8 = FPC8: 8 pin FPC, Top contacts position; Order: FN 2614916; Notes: FPC Board Connector, 0.5 mm, 8 Contacts, Receptacle,Top contact position
R42 = RES: Resistor; Order: FN 157-6459; QT Order: QCR-00326; Price: 0.061
R43 R44 R47-R49 = RES: as R21a on sheet ui_conn
  R43 R44: Price: 0.03
  R47-R49: Price: 0.024
R45 = RES: Resistor; Order: FN 188-7289; QT Order: QCR-00333; QT Price: 0.03; Price: 0.075
R46 = RES: Resistor; Order: FN 207-3875; QT Order: QCR-00419; QT Price: 0.03; Notes: What is the biggest power rating to fit into 1206 ?; Price: 0.024
RFC5 = Inductor: Power Inductor; QT Order: QCL-00097; QT Price: 0.085; Notes: Don't we already have selection for 0.8.0(bigger than 0805) ?; Price: 0
RFC6 = Inductor: Power Inductor; QT Order: QCL-00097; QT Price: 0.085; Price: 0
U7 = RT9293B: Charge Pump; Order: Hotmcu.com; QT Order: QCI-01775; QT Price: 0.27; Notes: Originally from Thomas, if not Ali; Price: 0.5

## Sheet ui_cpu_power.SchDoc: mcHF Pro Transceiver UI board
size A3; Author: Krassi Atanassov; CompanyName: MØNKA; Engineer: For radio amateurs experimentation, non-commercial use only. Thank you!; Revision: 0.8.5; SheetTotal: 13
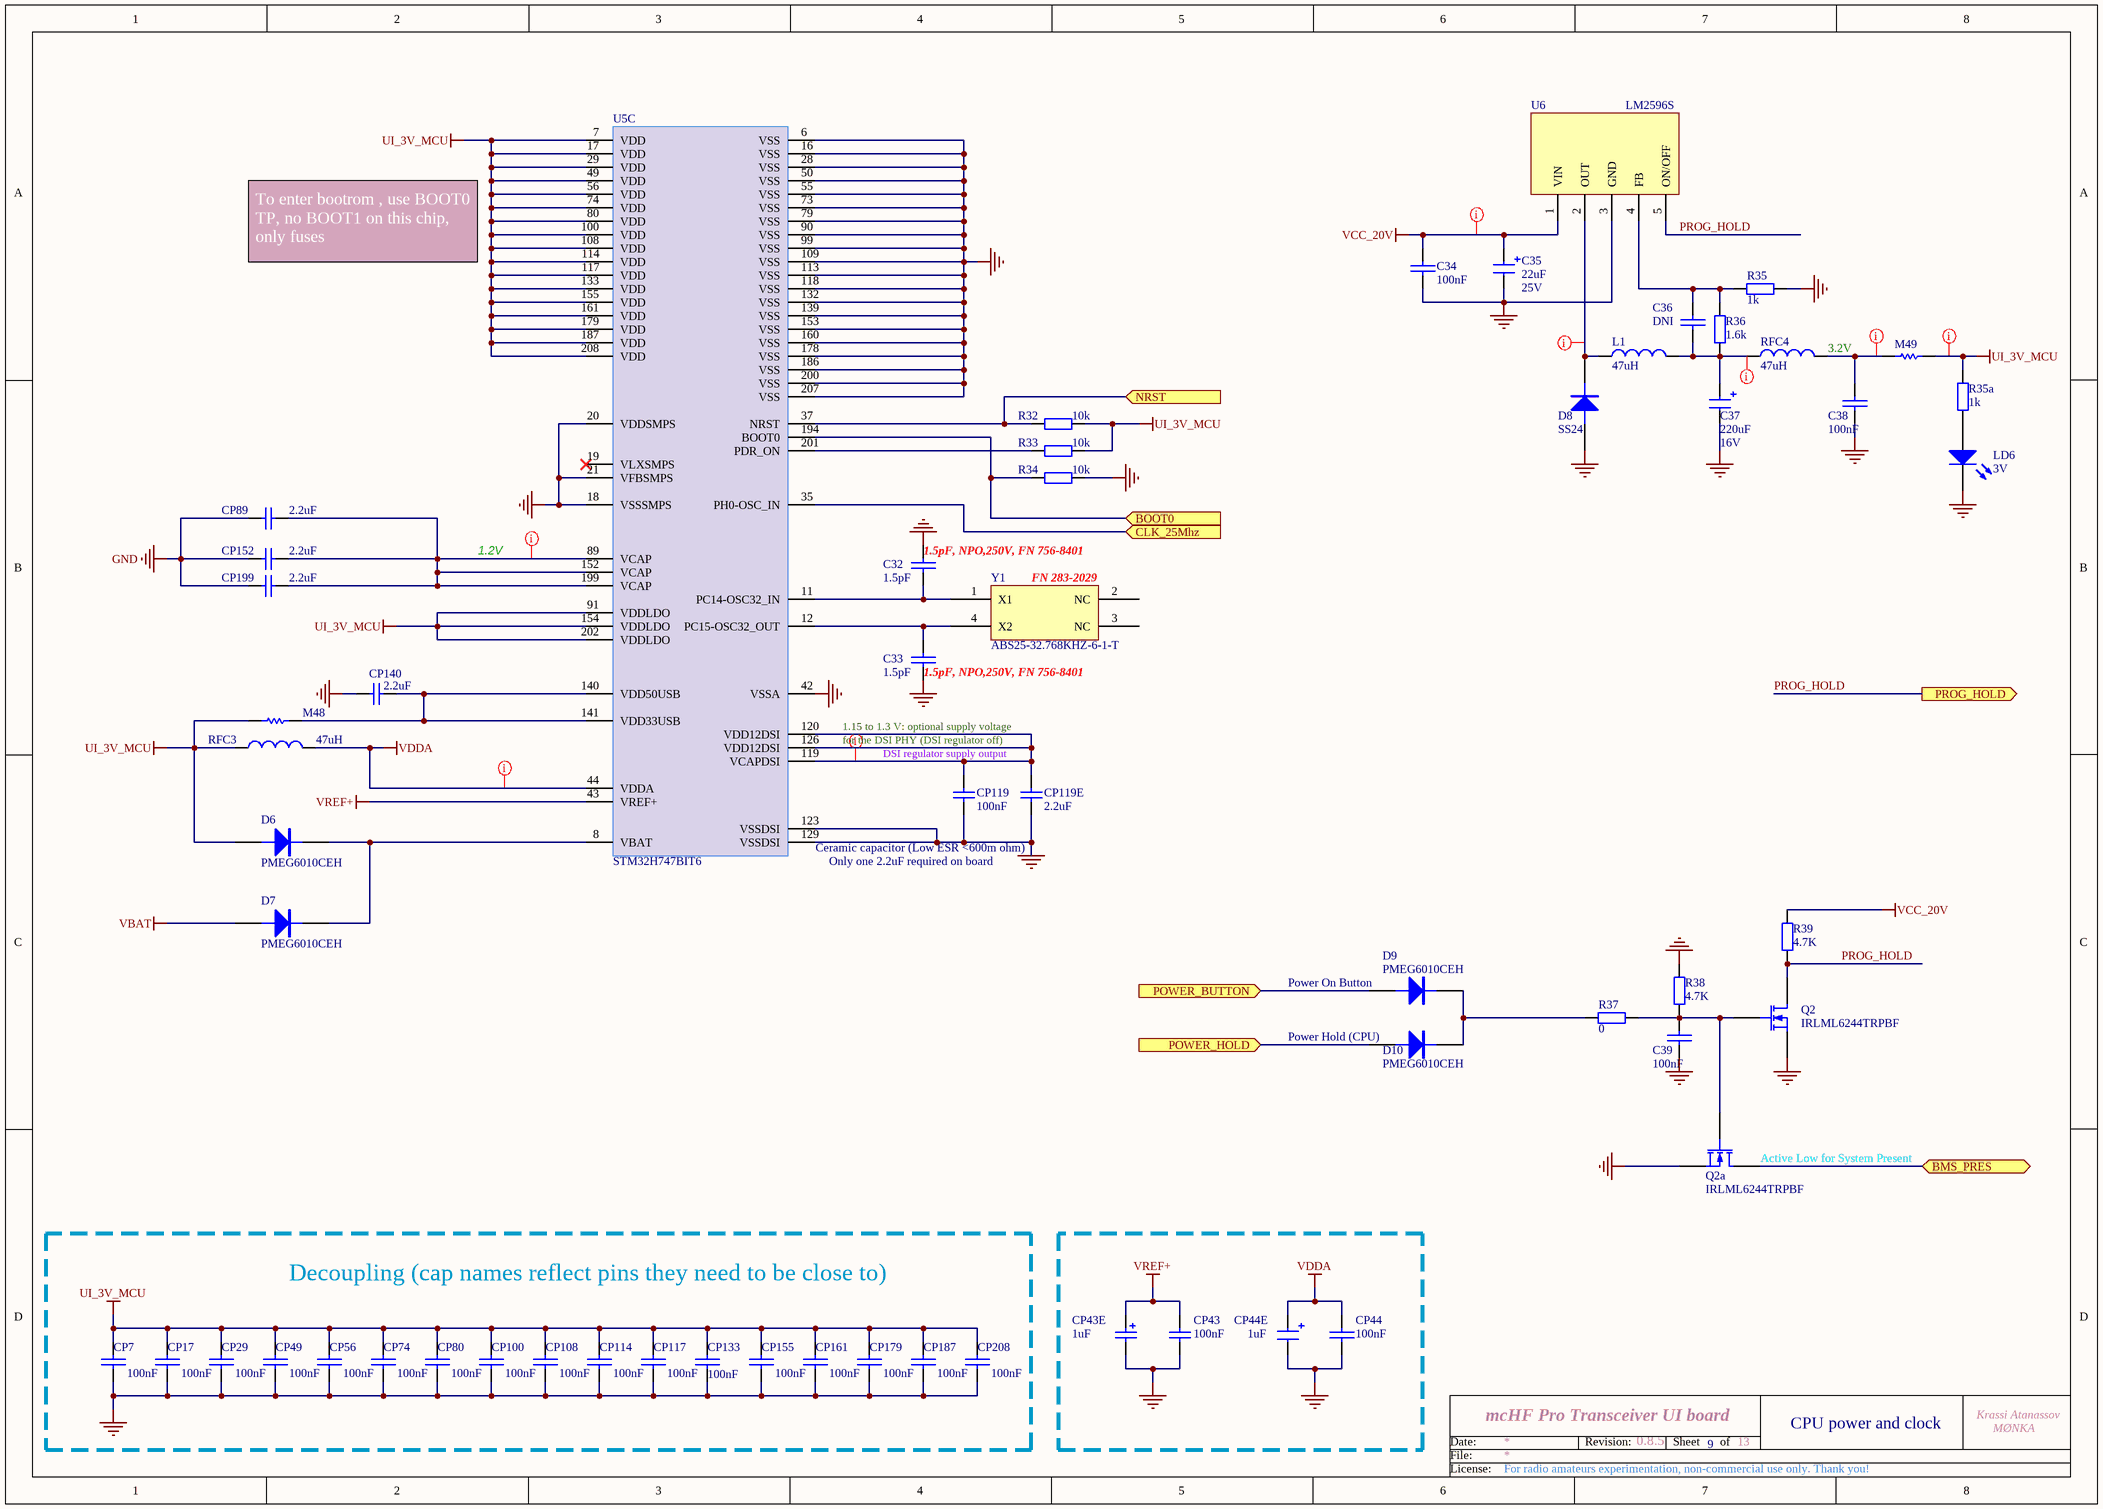
[diagram p6: ui_cpu_power.SchDoc]

### Parts
C32  1.5pF  [0805]
C33  1.5pF  [0805]
C34  100nF  [0805]
C35  22uF  Voltage: 25V  [1206_Elec_Cap]
C36  DNI  [0805]  (no BOM)
C37  220uF  Voltage: 16V  [CAP_ALUM_Pro]
C38  100nF  [0805]
C39  100nF  [0805]
CP7  100nF  [0805]
CP17  100nF  [0805]
CP29  100nF  [0805]
CP43  100nF  [0805]
CP43E  1uF  [1206_Elec_Cap]
CP44  100nF  [0805]
CP44E  1uF  [1206_Elec_Cap]
CP49  100nF  [0805]
CP56  100nF  [0805]
CP74  100nF  [0805]
CP80  100nF  [0805]
CP89  2.2uF  [0805]
CP100  100nF  [0805]
CP108  100nF  [0805]
CP114  100nF  [0805]
CP117  100nF  [0805]
CP119  100nF  [0805]
CP119E  2.2uF  [0805]
CP133  100nF  [0805]
CP140  2.2uF  [0805]
CP152  2.2uF  [0805]
CP155  100nF  [0805]
CP161  100nF  [0805]
CP179  100nF  [0805]
CP187  100nF  [0805]
CP199  2.2uF  [0805]
CP208  100nF  [0805]
D6  PMEG6010CEH  [SOD87]
D7  PMEG6010CEH  [SOD87]
D8  SS24  [DO214]
D9  PMEG6010CEH  [SOD87]
D10  PMEG6010CEH  [SOD87]
L1  47uH  [CD75]
LD6  3V  [1206_Elec_Cap]  (no BOM)
M48  0  [SB_0603]  (value not drawn)  (net tie, no BOM)
M49  0  [SB_0603]  (value not drawn)  (net tie, no BOM)
Q2  IRLML6244TRPBF  [SOT-23-Pro]
Q2a  IRLML6244TRPBF  [SOT-23-Pro]
R32  10k  [0805]
R33  10k  [0805]
R34  10k  [0805]
R35  1k  [0805]
R35a  1k  [0805]
R36  1.6k  [0805]
R37  0  [0805]
R38  4.7K  [0805]
R39  4.7K  [0805]
RFC3  47uH  [0805]
RFC4  47uH  [CD75]
U5  STM32H747BIT6  [LQFP208-28x28x1.4]  (part C of 3)
U6  LM2596S  [TO-263-5]
Y1  ABS25-32.768KHZ-6-1-T  [DSO-N4]

### Blocks framed on the sheet
Decoupling (cap names reflect pins they need to be close to): CP7 CP17 CP29 CP49 CP56 CP74 CP80 CP100 CP108 CP114 CP117 CP133 CP155 CP161 CP179 CP187 CP208

### Ports
BMS_PRES (bidir), BOOT0 (in), CLK_25Mhz (in), NRST (in), POWER_BUTTON (in), POWER_HOLD (in), PROG_HOLD (out)

### Nets
GND: C32.2 C33.1 C34.2 C35.2 C37.2 C38.2 C39.2 CP7.2 CP17.2 CP29.2 CP43.1 CP43E.2 CP44.2 CP44E.2 CP49.2 CP56.2 CP74.2 CP80.2 CP89.1 CP100.2 CP108.2 CP114.2 CP117.2 CP119.2 CP119E.2 CP133.2 CP140.2 CP152.1 CP155.2 CP161.2 CP179.2 CP187.2 CP199.1 CP208.2 D8.1(A) LD6.2(K) Q2.2(S) Q2a.2(S) R34.1 R35.2 R38.2 U5.6(VSS) U5.16(VSS) U5.18(VSSSMPS) U5.20(VDDSMPS) U5.21(VFBSMPS) U5.28(VSS) U5.42(VSSA) U5.50(VSS) U5.55(VSS) U5.73(VSS) U5.79(VSS) U5.90(VSS) U5.99(VSS) U5.109(VSS) U5.113(VSS) U5.118(VSS) U5.123(VSSDSI) U5.129(VSSDSI) U5.132(VSS) U5.139(VSS) U5.153(VSS) U5.160(VSS) U5.178(VSS) U5.186(VSS) U5.200(VSS) U5.207(VSS) U6.3(GND)
UI_3V_MCU: CP7.1 CP17.1 CP29.1 CP49.1 CP56.1 CP74.1 CP80.1 CP100.1 CP108.1 CP114.1 CP117.1 CP133.1 CP155.1 CP161.1 CP179.1 CP187.1 CP208.1 D6.1(A) M48.1 M49.2 R32.1 R33.1 R35a.2 RFC3.1 U5.7(VDD) U5.17(VDD) U5.29(VDD) U5.49(VDD) U5.56(VDD) U5.74(VDD) U5.80(VDD) U5.91(VDDLDO) U5.100(VDD) U5.108(VDD) U5.114(VDD) U5.117(VDD) U5.133(VDD) U5.154(VDDLDO) U5.155(VDD) U5.161(VDD) U5.179(VDD) U5.187(VDD) U5.202(VDDLDO) U5.208(VDD)
VBAT: D7.1(A)
VCC_20V: C34.1 C35.1 R39.2 U6.1(VIN)
VDDA: CP44.1 CP44E.1 RFC3.2 U5.44(VDDA)
VREF+: CP43.2 CP43E.1 U5.43(VREF+)
BMS_PRES: Q2a.3(D) ; port BMS_PRES
BOOT0: R34.2 U5.194(BOOT0) ; port BOOT0
NRST: R32.2 U5.37(NRST) ; port NRST
POWER_BUTTON: D9.1(A) ; port POWER_BUTTON
POWER_HOLD: D10.1(A) ; port POWER_HOLD
PROG_HOLD: Q2.3(D) R39.1 U6.5(ON/OFF) ; port PROG_HOLD
NetC32_1: C32.1 U5.11(PC14-OSC32_IN) Y1.1(X1)
NetC33_2: C33.2 U5.12(PC15-OSC32_OUT) Y1.4(X2)
NetC36_1: C36.1 R35.1 R36.2 U6.4(FB)
NetC36_2: C36.2 C37.1 L1.2 R36.1 RFC4.1
NetC38_1: C38.1 M49.1 RFC4.2
NetC39_1: C39.1 Q2.1(G) Q2a.1(G) R37.2 R38.1
NetCP89_2: CP89.2 CP152.2 CP199.2 U5.89(VCAP) U5.152(VCAP) U5.199(VCAP)
NetCP119_1: CP119.1 CP119E.1 U5.119(VCAPDSI) U5.120(VDD12DSI) U5.126(VDD12DSI)
NetCP140_1: CP140.1 M48.2 U5.140(VDD50USB) U5.141(VDD33USB)
NetD6_2: D6.2(K) D7.2(K) U5.8(VBAT)
NetD8_2: D8.2(K) L1.1 U6.2(OUT)
NetD9_2: D9.2(K) D10.2(K) R37.1
NetLD6_1: LD6.1(A) R35a.1
NetR33_2: R33.2 U5.201(PDR_ON)
NetR59_1: U5.35(PH0-OSC_IN) ; port CLK_25Mhz

Not connected (* = marked no-connect by the designer): U5 19(VLXSMPS)*; Y1 2(NC) 3(NC)

### Layout directives
rule Width Constraint [Pref Width = 12mil    Min Width = 12mil    Max Width = 12mil]: NetCP89_2, NetCP119_1, UI_3V_MCU, VDDA
rule Width Constraint [Pref Width = 30mil    Min Width = 30mil    Max Width = 30mil]: NetC36_2, NetC38_1, NetD8_2, VCC_20V

### Notes on the sheet
- To enter bootrom , use BOOT0 TP, no BOOT1 on this chip, only fuses
- (near RFC4) 3.2V
- 1.2V
- (near C32) 1.5pF, NPO,250V, FN 756-8401
- (near Y1) FN 283-2029
- (near C33) 1.5pF, NPO,250V, FN 756-8401
- 1.15 to 1.3 V: optional supply voltage
- for the DSI PHY (DSI regulator off)
- DSI regulator supply output
- Ceramic capacitor (Low ESR <600m ohm)
- Only one 2.2uF required on board
- (near D9) Power On Button
- (near D10) Power Hold (CPU)
- (near Q2a) Active Low for System Present
- 6
- CPU power and clock
- Date:
- File:
- Revision:
- Sheet
- of
- License:

### Library data of the parts
C32 = CAP: Capacitor; Order: FN 756-8401; QT Order: QCC-00266; QT Price: 0.045; Price: 0.341
C33 = CAP: Capacitor; Order: FN 756-8401; QT Order: QCC-00266; Price: 0.341
C34 C36 C38 C39 = CAP: Capacitor; Voltage: 100V; QT Order: QCC-00154; Price: 0.068
C35 C37 = CAP-POL: Electrolitic capacitor; QT Order: QCC-00202; Price: 0.235
CP7 CP17 CP29 CP44 CP49 CP56 CP74 CP80 CP100 CP108 CP114 CP117 CP133 CP155 CP161 CP179 CP187 CP208 = CAP: as C29 on sheet ui_front; Price: 0.089
CP43 CP199 = Cap: Capacitor; Value: 10nF; Published: 8-Jun-2000; Revision: July-2002: Re-released for DXP Platform.; Publisher: Altium Limited
CP43E = Cap Pol1: Value: 10uF; Published: 8-Jun-2000; Revision: July-2002: Re-released for DXP Platform.; Publisher: Altium Limited
CP44E = CAP-POL: Electrolitic capacitor; Order: FN 145-7406; QT Order: QCC-00172; Price: 0.235
CP89 CP152 = cap: Capacitor; Value: 100nF; Ordered by: Subcon; ECCN_US/EU: NA; Fitted: NO; Notes: Ceramic capacitor, low ESR; Published: 8-Jun-2000; Revision: July-2002: Re-released for DXP Platform.; Publisher: Altium Limited
CP119 = CAP: Capacitor; Published: 8-Jun-2000; Revision: July-2002: Re-released for DXP Platform.; Publisher: Altium Limited; Value: 100nF
CP119E = CAP: Capacitor; Value: 100nF; Published: 8-Jun-2000; Revision: July-2002: Re-released for DXP Platform.; Publisher: Altium Limited
CP140 = CAP SMD 0603  X5R 1礔 25V 10%: 0603  X5R 1礔; Rated voltage: 25V; Tolerance: 10%; Manufacturer: *; Manufacturer P/N: *; Order code Farnell: 1288202RL; Value: 1礔; Power: *; Technology: X5R; Temperature  Factor: *; Temperature Max: +125癈; Temperature Min: -55癈; STS Code: *
D6-D10 = PMEG6010CEH: DIODE, SCHOTTKY, 1A, 60V, SOD-123F; QT Order: QCD-00034; Price: 0.085
L1 RFC4 = TDK-NLV25T: POWER INDUCTOR, 47UH, 1210; Price: 0.166; Notes: Power inductor
LD6 = LED2: LED 3mm; QT Order: QCD-00052; Revision: July-2002: Re-released for DXP Platform.; Price: 0.116
M48 M49 = Link: Value: 1K; Published: 8-Jun-2000; Revision: July-2002: Re-released for DXP Platform.; Publisher: Altium Limited
Q2 Q2a = MOSFET-N: N-Channel MOSFET; QT Order: QCT-00022; QT Price: 0.28; Price: 0.231
R32-R34 = RES: Resistor; Order: FN 146-9857; Price: 0.046
R35 R35a R39 = RES: Resistor; QT Order: QCR-00341; Price: 0.024
R36 = RES: Resistor; Order: 652-CR0805JW-162ELF; QT Order: QCR-00341; Price: 0.024
R37 R38 = RES: Resistor
RFC3 = Inductor: Value: 100uH; Published: 8-Jun-2000; Revision: July-2002: Re-released for DXP Platform.; Publisher: Altium Limited
U5 = STM32H747BIT6: as U5 on sheet ui_cpu; Price: 10.97
U6 = LM2596S: V REG ADJ +5/20V, SMPS TO-263-5; Notes: In bulk from Ali; Price: 1.28
Y1 = SmdCrystal: 32kHz Crystal; Order: FN 283-2029; Price: 0.34